# EAGLE design sr_controller_v1_revD (EAGLE 6.3)
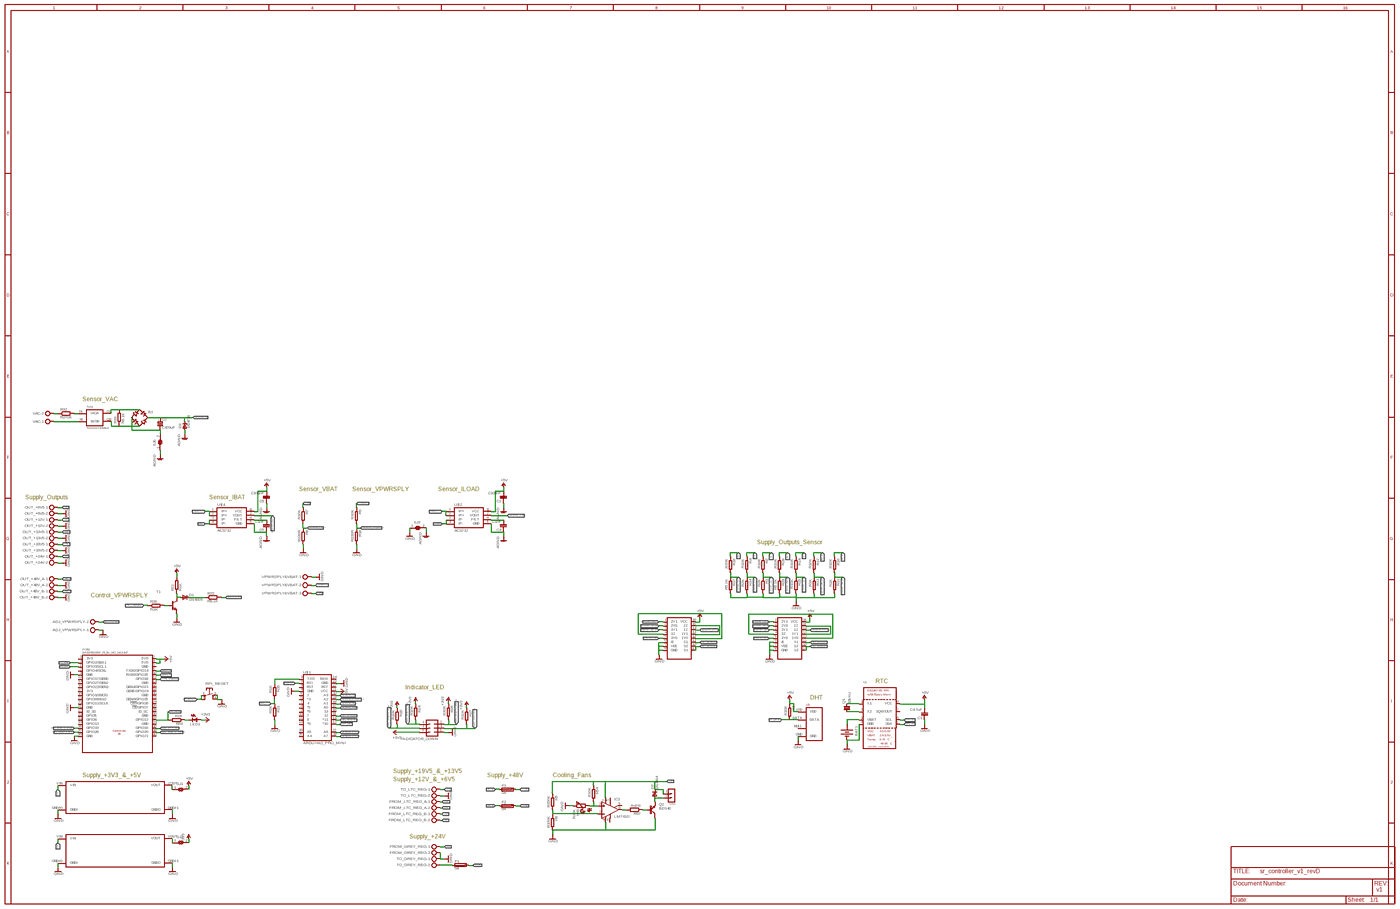
[diagram p0: schematic, sheet 1, overview]
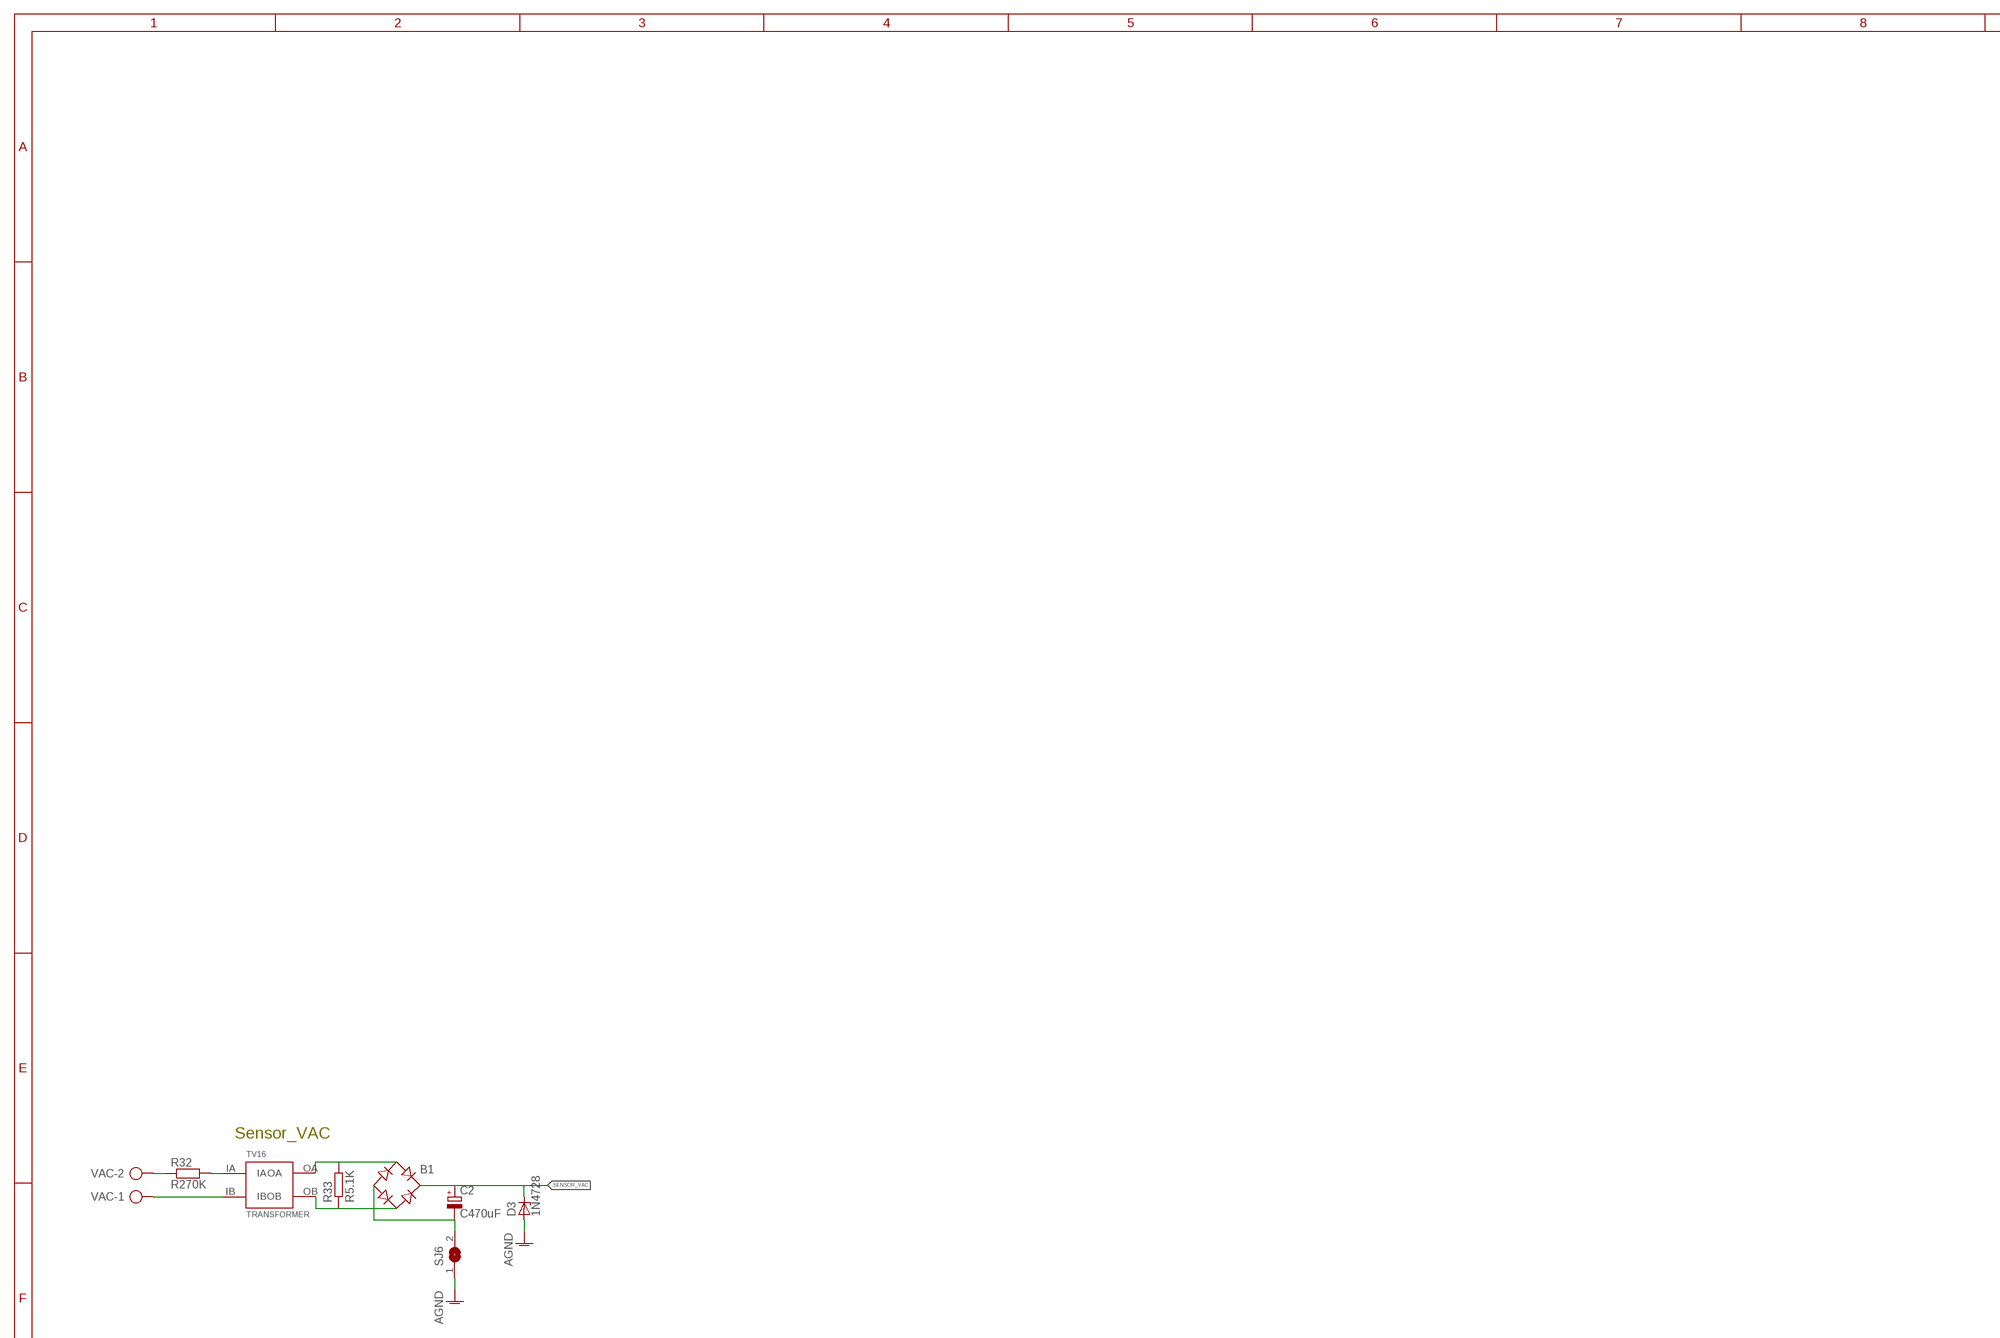
[diagram p1: schematic, sheet 1, part 1 of 4]
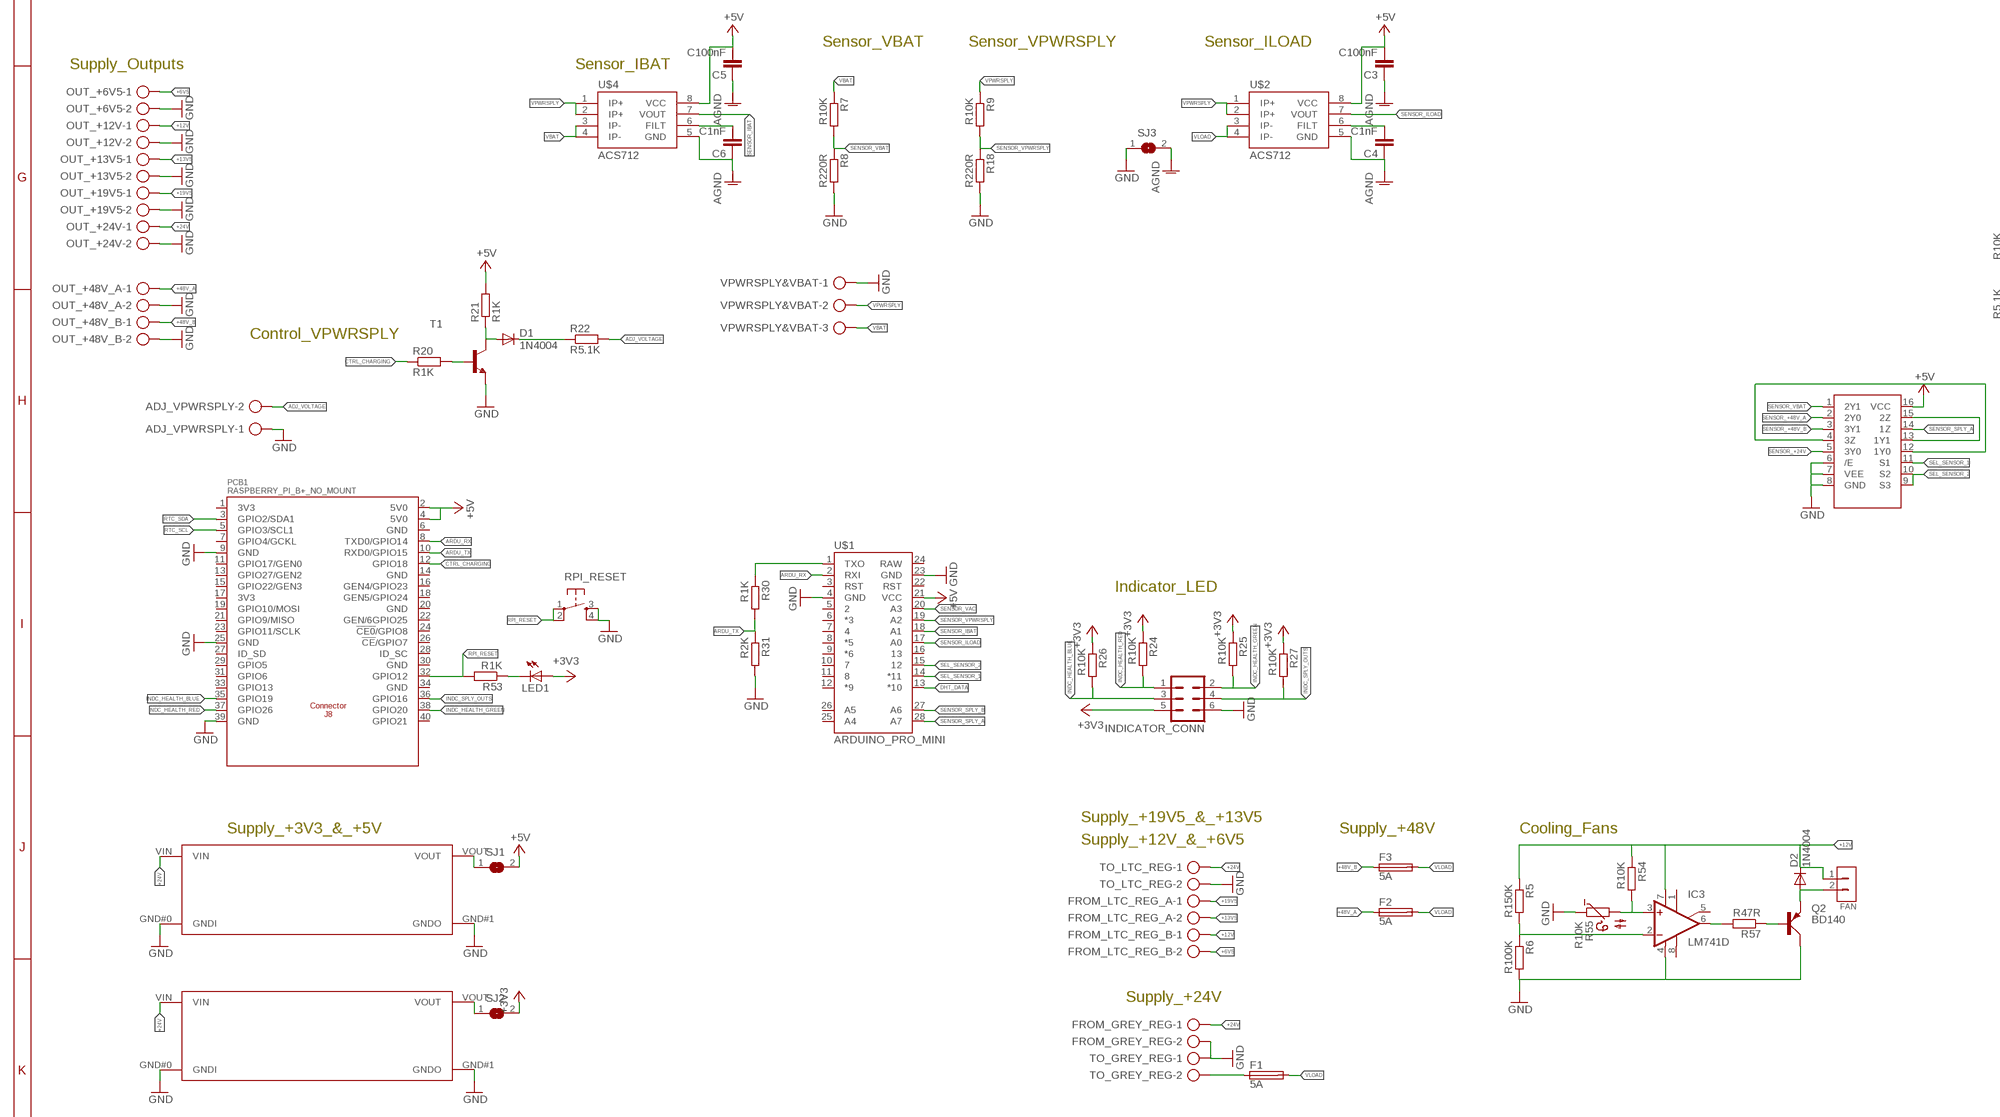
[diagram p2: schematic, sheet 1, part 2 of 4]
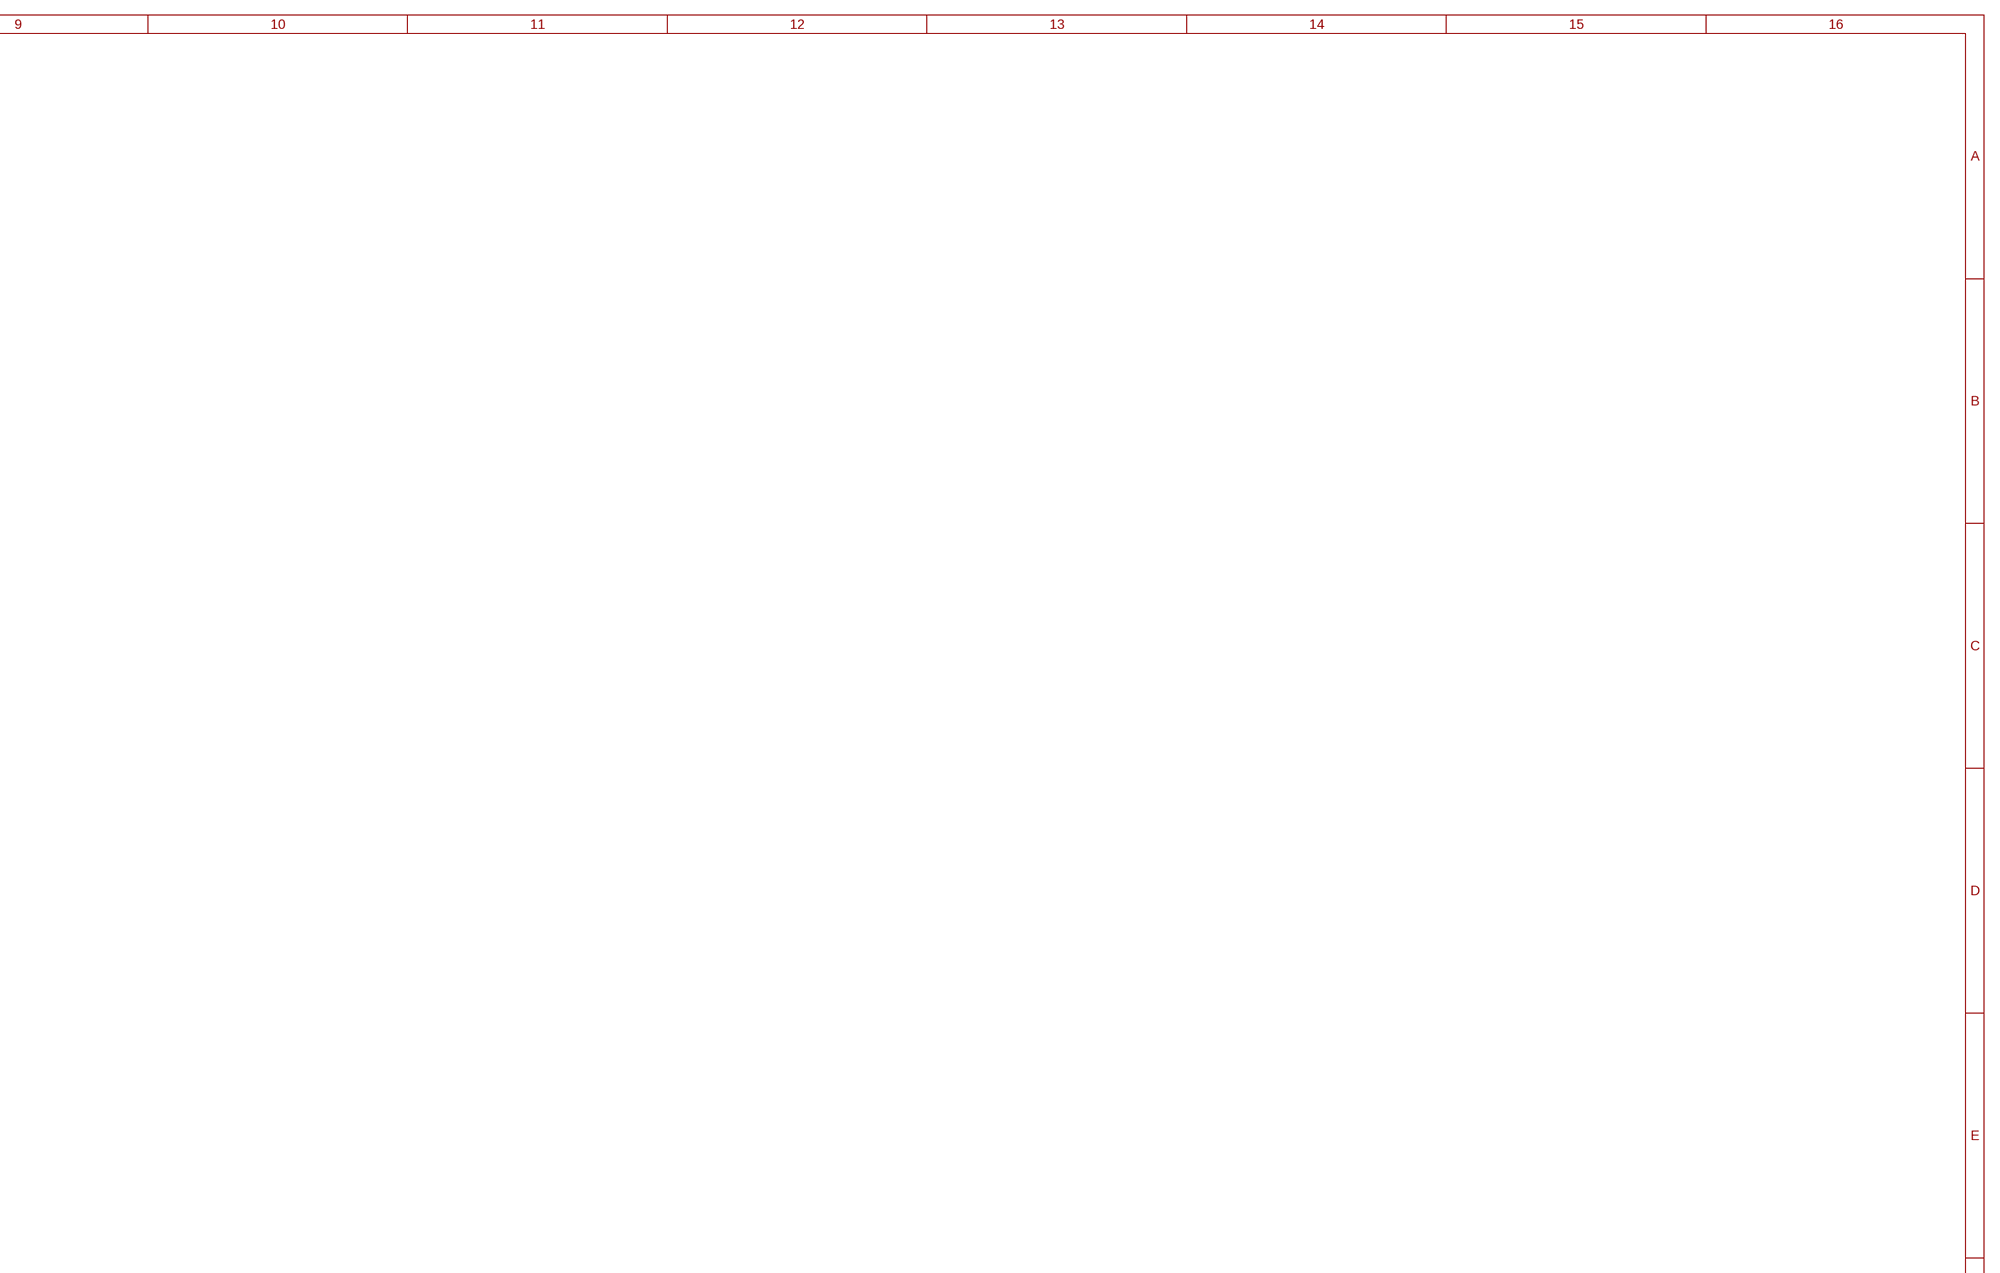
[diagram p3: schematic, sheet 1, part 3 of 4]
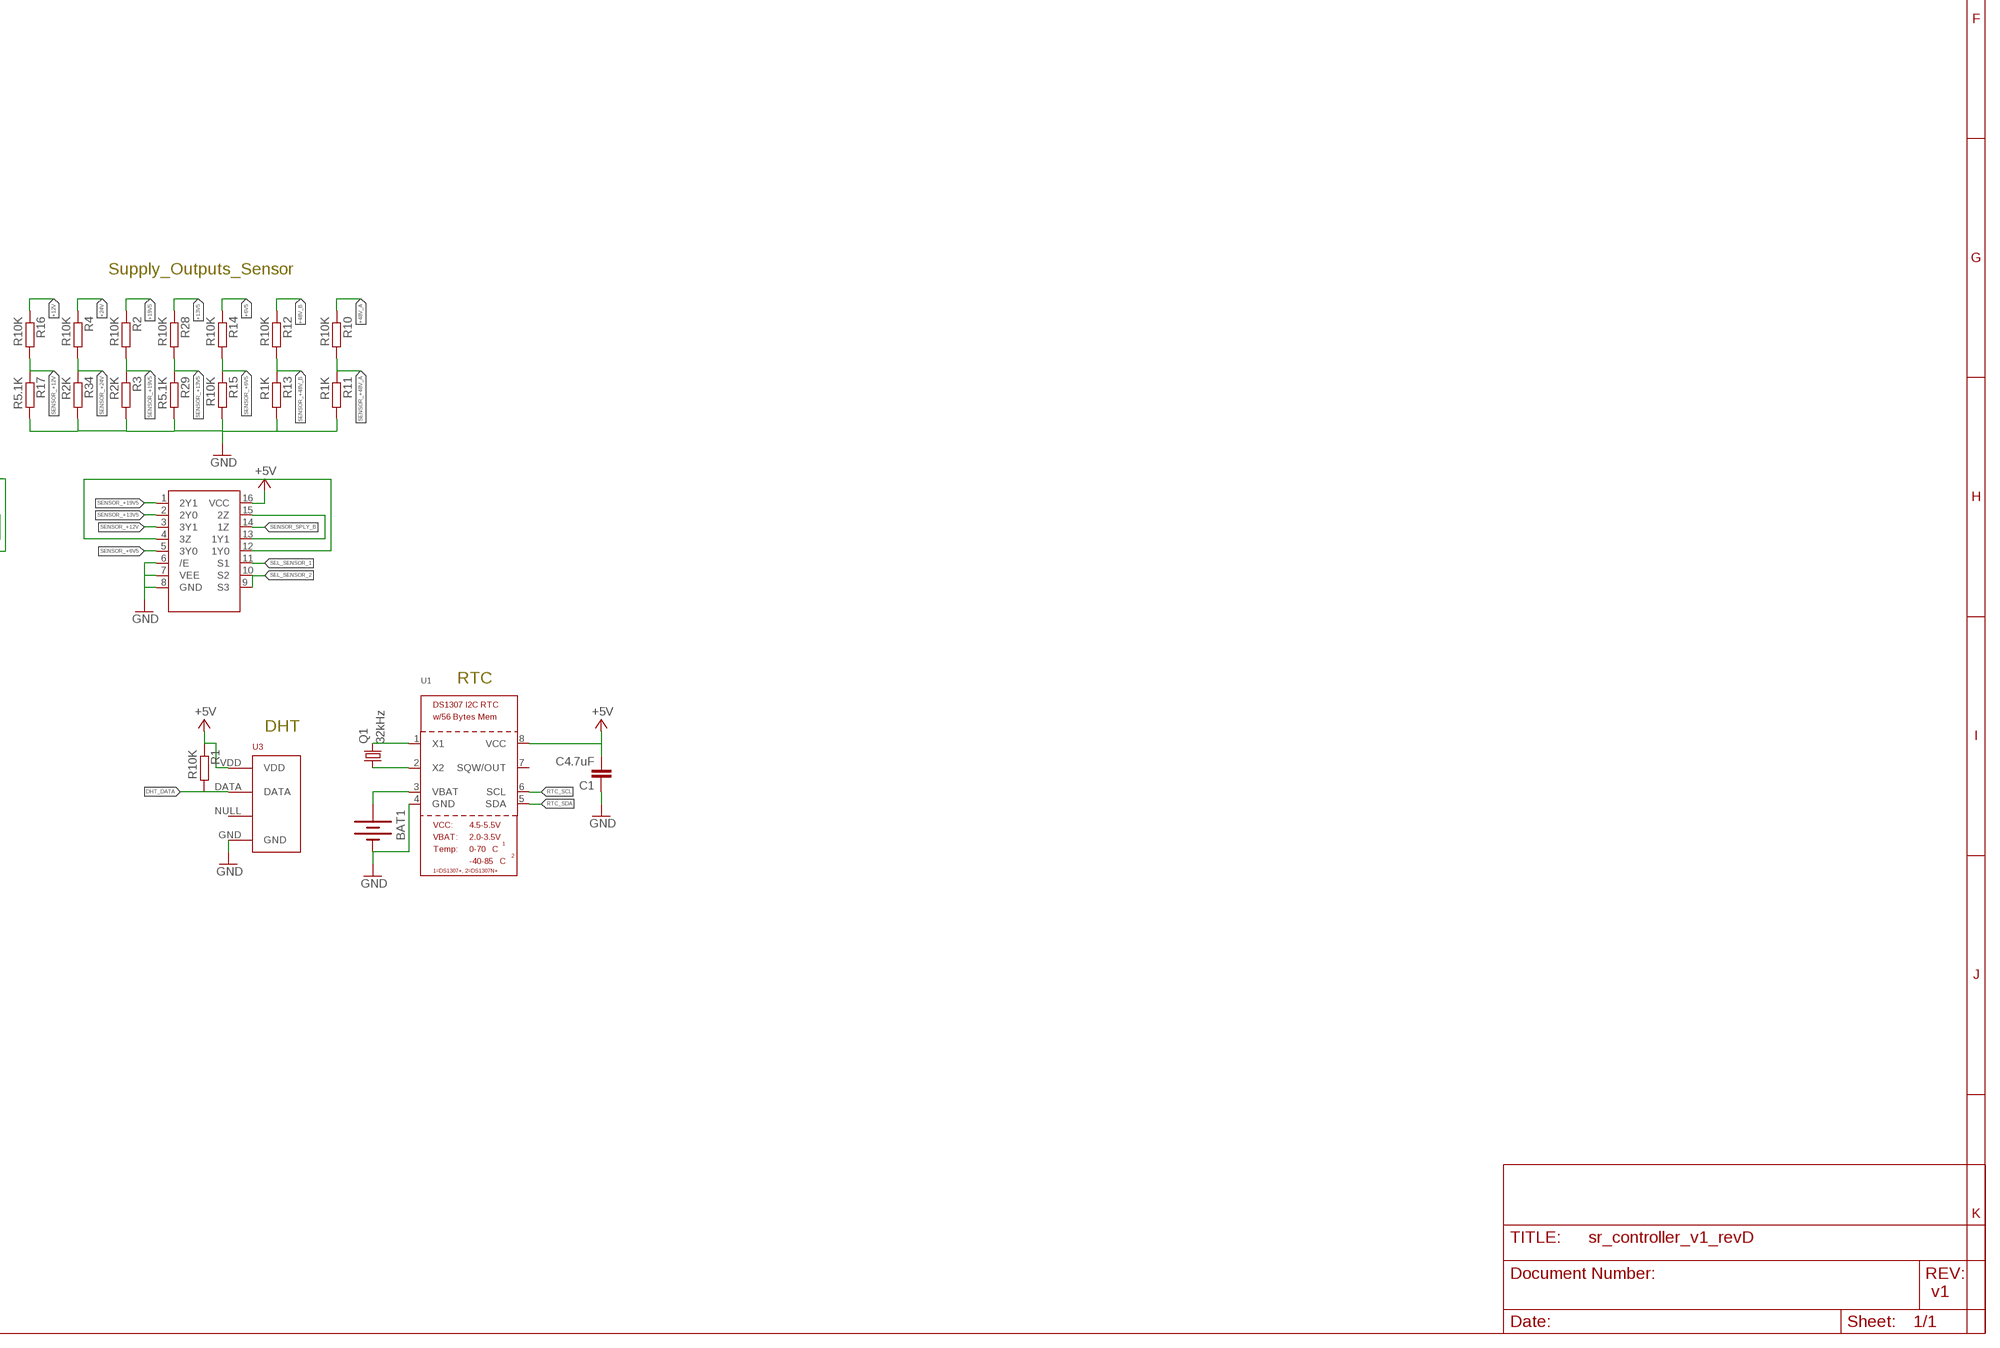
[diagram p4: schematic, sheet 1, part 4 of 4]

## Parts
ADJ_VPWRSPLY  AK300/2  [AK300/2]
B1  RB1A  [RB1A]
BAT1  BATTERY20PTH  [BATTCOM_20MM_PTH]
C1  C4.7uF  C-EUC0805  [C0805]
C2  C470uF  CPOL-EUE3.5-8  [E3,5-8]
C3  C100nF  C-EUC0805K  [C0805K]
C4  C1nF  C-EUC0805K  [C0805K]
C5  C100nF  C-EUC0805K  [C0805K]
C6  C1nF  C-EUC0805K  [C0805K]
D1  1N4004  [DO41-10]
D2  1N4004  [DO41-10]
D3  1N4728  [DO41Z10]
F1  5A  BLADE_FUSE_HOLDER  [BLADE_FUSE_HOLDER]
F2  5A  BLADE_FUSE_HOLDER  [BLADE_FUSE_HOLDER]
F3  5A  BLADE_FUSE_HOLDER  [BLADE_FUSE_HOLDER]
FAN  HEADER_1X02  [HEADER_1X02]
FROM_GREY_REG  AK300/2  [AK300/2]
FROM_LTC_REG_A  AK300/2  [AK300/2]
FROM_LTC_REG_B  AK300/2  [AK300/2]
IC3  LM741D  [SO08]
INDICATOR_CONN  MA03-2  [MA03-2]
LED1  LEDCHIP-LED0805  [CHIP-LED0805]
OUT_+6V5  AK500/2  [AK500/2]
OUT_+12V  AK500/2  [AK500/2]
OUT_+13V5  AK500/2  [AK500/2]
OUT_+19V5  AK500/2  [AK500/2]
OUT_+24V  AK500/2  [AK500/2]
OUT_+48V_A  AK500/2  [AK500/2]
OUT_+48V_B  AK500/2  [AK500/2]
PCB1  RASPBERRY_PI_B+_NO_MOUNT  [RASPBERRY_PI_B+]
Q1  32kHz  CRYSTALTC38H  [TC38H]
Q2  BD140  [TO126AV]
R1  R10K  R-EU_R0805  [R0805]
R2  R10K  R-EU_R0805  [R0805]
R3  R2K  R-EU_R0805  [R0805]
R4  R10K  R-EU_R0805  [R0805]
R5  R150K  R-EU_R0805  [R0805]
R6  R100K  R-EU_R0805  [R0805]
R7  R10K  R-EU_R0805  [R0805]
R8  R220R  R-EU_R0805  [R0805]
R9  R10K  R-EU_R0805  [R0805]
R10  R10K  R-EU_R0805  [R0805]
R11  R1K  R-EU_R0805  [R0805]
R12  R10K  R-EU_R0805  [R0805]
R13  R1K  R-EU_R0805  [R0805]
R14  R10K  R-EU_R0805  [R0805]
R15  R10K  R-EU_R0805  [R0805]
R16  R10K  R-EU_R0805  [R0805]
R17  R5.1K  R-EU_R0805  [R0805]
R18  R220R  R-EU_R0805  [R0805]
R20  R1K  R-EU_R0805  [R0805]
R21  R1K  R-EU_R0805  [R0805]
R22  R5.1K  R-EU_R0805  [R0805]
R24  R10K  R-EU_R0805  [R0805]
R25  R10K  R-EU_R0805  [R0805]
R26  R10K  R-EU_R0805  [R0805]
R27  R10K  R-EU_R0805  [R0805]
R28  R10K  R-EU_R0805  [R0805]
R29  R5.1K  R-EU_R0805  [R0805]
R30  R1K  R-EU_R0805  [R0805]
R31  R2K  R-EU_R0805  [R0805]
R32  R270K  R-EU_0309/10  [0309/10]
R33  R5.1K  R-EU_0309/10  [0309/10]
R34  R2K  R-EU_R0805  [R0805]
R53  R1K  R-EU_R0805  [R0805]
R54  R10K  R-EU_R0805  [R0805]
R55  R10K  NTC642-6  [P642]
R57  R47R  R-EU_R0805  [R0805]
RPI_RESET  TAC_SWITCHPTH  [TACTILE-PTH]
SJ1  SOLDERJUMPER  [SOLDERJUMPER_ARROW_NOPASTE]
SJ2  SOLDERJUMPER  [SOLDERJUMPER_ARROW_NOPASTE]
SJ3  SOLDERJUMPERCLOSED  [SOLDERJUMPER_CLOSEDWIRE]
SJ6  SOLDERJUMPERREFLOW  [SOLDERJUMPER_REFLOW]
T1  MMBT2222ALT1-NPN-SOT23-BEC  [SOT23-BEC]
TO_GREY_REG  AK300/2  [AK300/2]
TO_LTC_REG  AK300/2  [AK300/2]
TV16  TRANSFORMER  [TV16]
U1  RTC_DS1307  [SOIC8_150MIL]
U3  RHT03_DHT-22_AM2302  [RHT03_DHT-22]
U$1  ARDUINO_PRO_MINI  [ARDUINO_PRO_MINI]
U$2  ACS712  [SO08]
U$3  DCDCMODULE  [DCDCMODULE]
U$4  ACS712  [SO08]
U$6  DCDCMODULE  [DCDCMODULE]
U$7  74HC4053D  [SO16]
U$8  74HC4053D  [SO16]
VAC  AK300/2  [AK300/2]
VPWRSPLY&VBAT  AK300/3  [AK300/3]

## Nets
+3V3: INDICATOR_CONN.5 LED1.A R24.1 R25.1 R26.1 R27.1 SJ2.2
+5V: C1.2 C3.2 C5.2 PCB1.2(5V0) PCB1.4(5V0) R1.1 R21.2 SJ1.2 U1.8(VCC) U3.VDD U$1.21(VCC) U$2.8(VCC) U$4.8(VCC) U$7.16(VCC) U$8.16(VCC)
+6V5: FROM_LTC_REG_B.2 OUT_+6V5.1 R14.1
+12V: D2.C FAN.1 FROM_LTC_REG_B.1 IC3.7(V+) OUT_+12V.1 R5.1 R16.1 R54.1
+13V5: FROM_LTC_REG_A.2 OUT_+13V5.1 R28.1
+19V5: FROM_LTC_REG_A.1 OUT_+19V5.1 R2.1
+24V: FROM_GREY_REG.1 OUT_+24V.1 R4.1 TO_LTC_REG.1 U$3.VIN U$6.VIN
+48V_A: F2.1 OUT_+48V_A.1 R10.1
+48V_B: F3.1 OUT_+48V_B.1 R12.1
ADJ_VOLTAGE: ADJ_VPWRSPLY.2 R22.2
AGND: C3.1 C4.1 C5.1 C6.1 D3.A SJ3.2 SJ6.1 U$2.5(GND) U$4.5(GND)
ARDU_RX: PCB1.8(TXD0/GPIO14) U$1.2(RXI)
ARDU_TX: PCB1.10(RXD0/GPIO15) R30.2 R31.1
CTRL_CHARGING: PCB1.12(GPIO18) R20.1
DHT_DATA: R1.2 U3.DATA U$1.13(*10)
GND: ADJ_VPWRSPLY.1 BAT1.2(-) C1.1 FROM_GREY_REG.2 IC3.4(V-) INDICATOR_CONN.6 OUT_+6V5.2 OUT_+12V.2 OUT_+13V5.2 OUT_+19V5.2 OUT_+24V.2 OUT_+48V_A.2 OUT_+48V_B.2 PCB1.9(GND) PCB1.25(GND) PCB1.39(GND) Q2.C R3.2 R6.2 R8.2 R11.2 R13.2 R15.2 R17.2 R18.2 R29.2 R31.2 R34.2 R55.1 RPI_RESET.3 RPI_RESET.4 SJ3.1 T1.E TO_GREY_REG.1 TO_LTC_REG.2 U1.4(GND) U3.GND U$1.4(GND) U$1.23(GND) U$3.GND#0(GNDI) U$3.GND#1(GNDO) U$6.GND#0(GNDI) U$6.GND#1(GNDO) U$7.6(/E) U$7.7(VEE) U$7.8(GND) U$8.6(/E) U$8.7(VEE) U$8.8(GND) VPWRSPLY&VBAT.1
INDC_HEALTH_BLUE: INDICATOR_CONN.3 PCB1.35(GPIO19) R26.2
INDC_HEALTH_GREEN: INDICATOR_CONN.2 PCB1.38(GPIO20) R25.2
INDC_HEALTH_RED: INDICATOR_CONN.1 PCB1.37(GPIO26) R24.2
INDC_SPLY_OUTS: INDICATOR_CONN.4 PCB1.36(GPIO16) R27.2
N$1: R32.1 VAC.2
N$2: TV16.IB VAC.1
N$3: Q1.2 U1.1(X1)
N$4: Q1.1 U1.2(X2)
N$5: BAT1.1(+) U1.3(VBAT)
N$6: U$8.13(1Y1) U$8.15(2Z)
N$7: U$8.4(3Z) U$8.12(1Y0)
N$8: SJ1.1 U$3.VOUT
N$9: SJ2.1 U$6.VOUT
N$10: C4.2 U$2.6(FILT)
N$11: U$7.13(1Y1) U$7.15(2Z)
N$12: LED1.C R53.1
N$15: IC3.3(+IN) R54.2 R55.2
N$16: C6.2 U$4.6(FILT)
N$17: F1.1 TO_GREY_REG.2
N$18: IC3.2(-IN) R5.2 R6.1
N$19: D1.A R21.1 T1.C
N$20: D2.A FAN.2 Q2.E
N$21: B1.AC1 R33.2 TV16.OA
N$22: R20.2 T1.B
N$24: D1.C R22.1
N$26: B1.- C2.- SJ6.2
N$28: U$7.4(3Z) U$7.12(1Y0)
N$35: R30.1 U$1.1(TXO)
N$36: R32.2 TV16.IA
N$38: B1.AC2 R33.1 TV16.OB
N$39: IC3.6(OUT) R57.2
N$40: Q2.B R57.1
RPI_RESET: PCB1.32(GPIO12) R53.2 RPI_RESET.1 RPI_RESET.2
RTC_SCL: PCB1.5(GPIO3/SCL1) U1.6(SCL)
RTC_SDA: PCB1.3(GPIO2/SDA1) U1.5(SDA)
SEL_SENSOR_1: U$1.14(*11) U$7.11(S1) U$8.11(S1)
SEL_SENSOR_2: U$1.15 U$7.9(S3) U$7.10(S2) U$8.9(S3) U$8.10(S2)
SENSOR_+6V5: R14.2 R15.1 U$8.5(3Y0)
SENSOR_+12V: R16.2 R17.1 U$8.3(3Y1)
SENSOR_+13V5: R28.2 R29.1 U$8.2(2Y0)
SENSOR_+19V5: R2.2 R3.1 U$8.1(2Y1)
SENSOR_+24V: R4.2 R34.1 U$7.5(3Y0)
SENSOR_+48V_A: R10.2 R11.1 U$7.2(2Y0)
SENSOR_+48V_B: R12.2 R13.1 U$7.3(3Y1)
SENSOR_IBAT: U$1.18(A1) U$4.7(VOUT)
SENSOR_ILOAD: U$1.17(A0) U$2.7(VOUT)
SENSOR_SPLY_A: U$1.28(A7) U$7.14(1Z)
SENSOR_SPLY_B: U$1.27(A6) U$8.14(1Z)
SENSOR_VAC: B1.+ C2.+ D3.C U$1.20(A3)
SENSOR_VBAT: R7.2 R8.1 U$7.1(2Y1)
SENSOR_VPWRSPLY: R9.2 R18.1 U$1.19(A2)
VBAT: R7.1 U$4.3(IP-) U$4.4(IP-) VPWRSPLY&VBAT.3
VLOAD: F1.2 F2.2 F3.2 U$2.3(IP-) U$2.4(IP-)
VPWRSPLY: R9.1 U$2.1(IP+) U$2.2(IP+) U$4.1(IP+) U$4.2(IP+) VPWRSPLY&VBAT.2
Unconnected: IC3.1(ON1) IC3.5(ON2) IC3.8(OPT) PCB1.1(3V3) PCB1.6(GND) PCB1.7(GPIO4/GCKL) PCB1.11(GPIO17/GEN0) PCB1.13(GPIO27/GEN2) PCB1.14(GND) PCB1.15(GPIO22/GEN3) PCB1.16(GEN4/GPIO23) PCB1.17(3V3) PCB1.18(GEN5/GPIO24) PCB1.19(GPIO10/MOSI) PCB1.20(GND) PCB1.21(GPIO9/MISO) PCB1.22(GEN/6GPIO25) PCB1.23(GPIO11/SCLK) PCB1.24(!CE0!/GPIO8) PCB1.26(!CE!/GPIO7) PCB1.27(ID_SD) PCB1.28(ID_SC) PCB1.29(GPIO5) PCB1.30(GND) PCB1.31(GPIO6) PCB1.33(GPIO13) PCB1.34(GND) PCB1.40(GPIO21) U1.7(SQW/OUT) U3.NULL U$1.3(RST) U$1.5 U$1.6(*3) U$1.7 U$1.8(*5) U$1.9(*6) U$1.10 U$1.11 U$1.12(*9) U$1.16 U$1.22(RST) U$1.24(RAW) U$1.25(A4) U$1.26(A5)

## Notes on the sheet
- Sensor_VAC
- Sensor_VBAT | Sensor_VPWRSPLY | Sensor_ILOAD
- Supply_Outputs | Sensor_IBAT
- Supply_Outputs_Sensor
- Control_VPWRSPLY
- RTC
- Indicator_LED
- DHT
- Supply_+19V5_&_+13V5
- Supply_+3V3_&_+5V | Supply_+48V | Cooling_Fans
- Supply_+12V_&_+6V5
- Supply_+24V
- v1

## Library data of the parts
ADJ_VPWRSPLY FROM_GREY_REG FROM_LTC_REG_A FROM_LTC_REG_B TO_GREY_REG TO_LTC_REG VAC = con-ptr500:AK300/2: CONNECTOR; OC_FARNELL: unknown; OC_NEWARK: unknown
B1 = rectifier:RB1A: RECTIFIER 1 A
BAT1 = SparkFun-Electromechanical:BATTERY: Battery Holders Various common sizes : AA, AAA, 20mm coin cell and 12mm coin cell. 20MM_4LEGS, BATT-10373
C1 C3-C6 = resistor:C-EU: CAPACITOR, European symbol
C2 = resistor:CPOL-EU: POLARIZED CAPACITOR, European symbol
D1 D2 = diode:1N4004: DIODE general purpose rectifier, 1 A
D3 = diode:1N4728: Z DIODE 3.3 V, 1W, 5 percent
F1-F3 = tigorcustom:BLADE_FUSE_HOLDER: FUSE HOLDER CS PFP30, Schukat; OC_FARNELL: unknown; OC_NEWARK: unknown
FAN = microbuilder:HEADER_1X02: 2-Pin 0,254cm / 0.1" Header
IC3 = linear:*741: OP AMP
INDICATOR_CONN = con-lstb:MA03-2: PIN HEADER; OC_FARNELL: unknown; OC_NEWARK: unknown
LED1 = led:LED: LED OSRAM: - CHIPLED LG R971, LG N971, LY N971, LG Q971, LY Q971, LO R971, LY R971 LH N974, LH R974 LS Q976, LO Q976, LY Q976 LO Q996 - Hyper CHIPLED LW Q18S LB Q993, LB Q99A, LB R99A - SideLED LS A670, LO A670, LY A670, LG A670, LP A670 LB A673, LV A673, LT A673, LW A673 LH A674 LY A675 LS A676, LA A676, LO A676, LY A676, LW A676 LS A679, LY A679, LG A679 - Hyper Micro SIDELED® LS Y876, LA Y876, LO Y876, LY Y876 LT Y87S - SmartLED LW L88C, LW L88S LB L89C, LB L89S, LG L890 LS L89K, LO L89K, LY L89K LS L896, LA L896, LO L896, LY L896 - TOPLED LS T670, LO T670, LY T670, LG T670, LP T670 LSG T670, LSP T670, LSY T670, LOP T670, LYG T670 LG T671, LOG T671, LSG T671 LB T673, LV T673, LT T673, LW T673 LH T674 LS T676, LA T676, LO T676, LY T676, LB T676, LH T676, LSB T676, LW T676 LB T67C, LV T67C, LT T67C, LS T67K, LO T67K, LY T67K, LW E67C LS E67B, LA E67B, LO E67B, LY E67B, LB E67C, LV E67C, LT E67C LW T67C LS T679, LY T679, LG T679 LS T770, LO T770, LY T770, LG T770, LP T770 LB T773, LV T773, LT T773, LW T773 LH T774 LS E675, LA E675, LY E675, LS T675 LS T776, LA T776, LO T776, LY T776, LB T776 LHGB T686 LT T68C, LB T68C - Hyper Mini TOPLED® LB M676 - Mini TOPLED Santana® LG M470 LS M47K, LO M47K, LY M47K Source: http://www.osram.convergy.de LUXEON: - LUMILED® LXK2-PW12-R00, LXK2-PW12-S00, LXK2-PW14-U00, LXK2-PW14-V00 LXK2-PM12-R00, LXK2-PM12-S00, LXK2-PM14-U00 LXK2-PE12-Q00, LXK2-PE12-R00, LXK2-PE12-S00, LXK2-PE14-T00, LXK2-PE14-U00 LXK2-PB12-K00, LXK2-PB12-L00, LXK2-PB12-M00, LXK2-PB14-N00, LXK2-PB14-P00, LXK2-PB14-Q00 LXK2-PR12-L00, LXK2-PR12-M00, LXK2-PR14-Q00, LXK2-PR14-R00 LXK2-PD12-Q00, LXK2-PD12-R00, LXK2-PD12-S00 LXK2-PH12-R00, LXK2-PH12-S00 LXK2-PL12-P00, LXK2-PL12-Q00, LXK2-PL12-R00 Source: www.luxeon.com KINGBRIGHT: KA-3528ASYC Source: www.kingbright.com
OUT_+6V5 OUT_+12V OUT_+13V5 OUT_+19V5 OUT_+24V OUT_+48V_A OUT_+48V_B = con-ptr500:AK500/2: CONNECTOR; OC_FARNELL: unknown; OC_NEWARK: unknown
PCB1 = tigorcustom:RASPBERRY_PI_B+_NO_MOUNT: Raspberry Pi B+ Based on issue: Thursday, July 10, 2014 - Rev 1.2 LBR by Tim R. 07-2014
Q1 = crystal:CRYSTAL: CRYSTAL; OC_FARNELL: unknown; OC_NEWARK: unknown
Q2 = transistor-power:BD140: PNP TRANSISTOR
R1-R18 R20-R22 R24-R34 R53 R54 R57 = resistor:R-EU_: RESISTOR, European symbol
R55 = ptc-ntc:NTC642-6: PHILIPS NTC; OC_FARNELL: unknown; OC_NEWARK: unknown
RPI_RESET = SparkFun-Electromechanical:TAC_SWITCH: Momentary Switch Button commonly used for reset or general input. Spark Fun Electronics SKU : COM-00097 SMT- SWCH-08247
SJ1 SJ2 = microbuilder:SOLDERJUMPER: SMD Solder JUMPER Solder the two pads together to create a connection, or remove the solder to break it. REFLOW - Use this footprint for solder paste and reflow ovens. WAVE - Use this footprint for hand-soldering (larger pads). CLOSED - Has a trace between the two pads to ensure it is closed by default. The trace needs to be cut to disable the jumper, and can be closed again by creating a solder bridge between the two pads.; BOM: EXCLUDE
SJ3 SJ6 = microbuilder:SOLDERJUMPER: SMD Solder JUMPER Solder the two pads together to create a connection, or remove the solder to break it. REFLOW - Use this footprint for solder paste and reflow ovens. WAVE - Use this footprint for hand-soldering (larger pads). CLOSED - Has a trace between the two pads to ensure it is closed by default. The trace needs to be cut to disable the jumper, and can be closed again by creating a solder bridge between the two pads.
T1 = transistor:*-NPN-: NPN Transistror BF959 corrected 2008.03.06
TV16 = bontor:TRANSFORMER
U1 = microbuilder:RTC_DS1307: DS1307 I2C RTC with 56-Bytes RAM
U3 = RHT03_DHT-22_AM2302:RHT03_DHT-22_AM2302: RHT03 / DHT-22 / AM2302 Packages and symbol for the RHT03 / DHT-22 relative humidity and temperature sensor. Note: The AM2302 is a wired version of the DHT-22 which typically requires less clearance and is thus provided as a separate package.; PROD_ID: SEN-10167
U$1 = tigorcustom:ARDUINO_PRO_MINI
U$2 U$4 = SparkFun-AnalogIC:ACS712: Hall-effect-based isolated linear current sensor
U$3 U$6 = bontor:DCDCMODULE
U$7 U$8 = tigorcustom:74HC4053D
VPWRSPLY&VBAT = con-ptr500:AK300/3: CONNECTOR; OC_FARNELL: unknown; OC_NEWARK: unknown

## Board
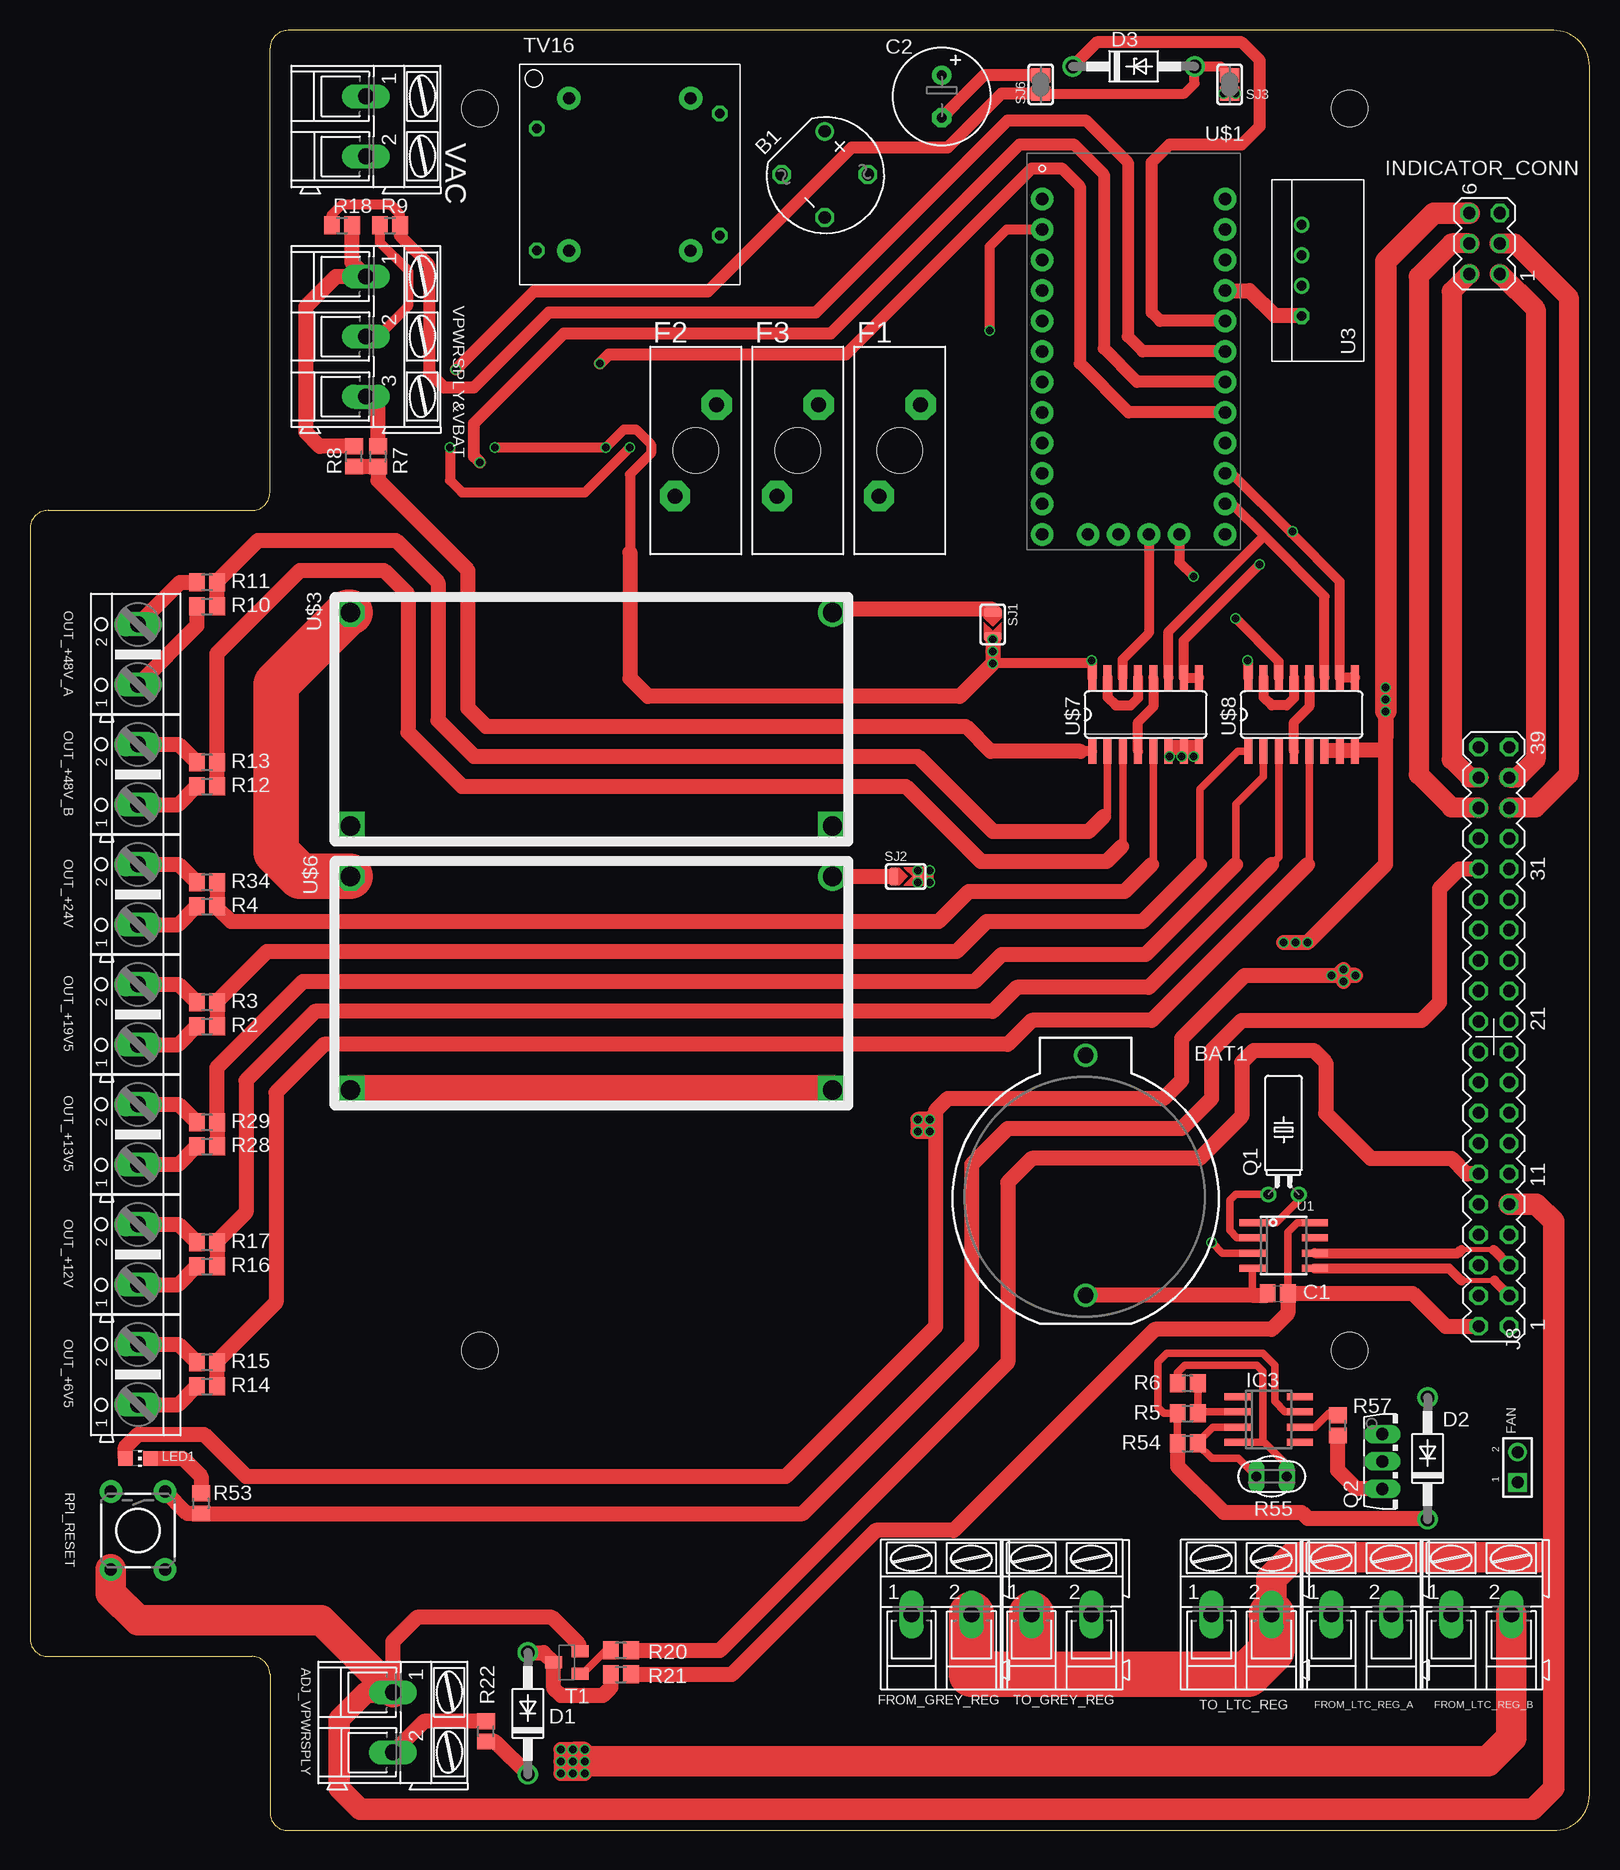
[diagram p5: board, top side]
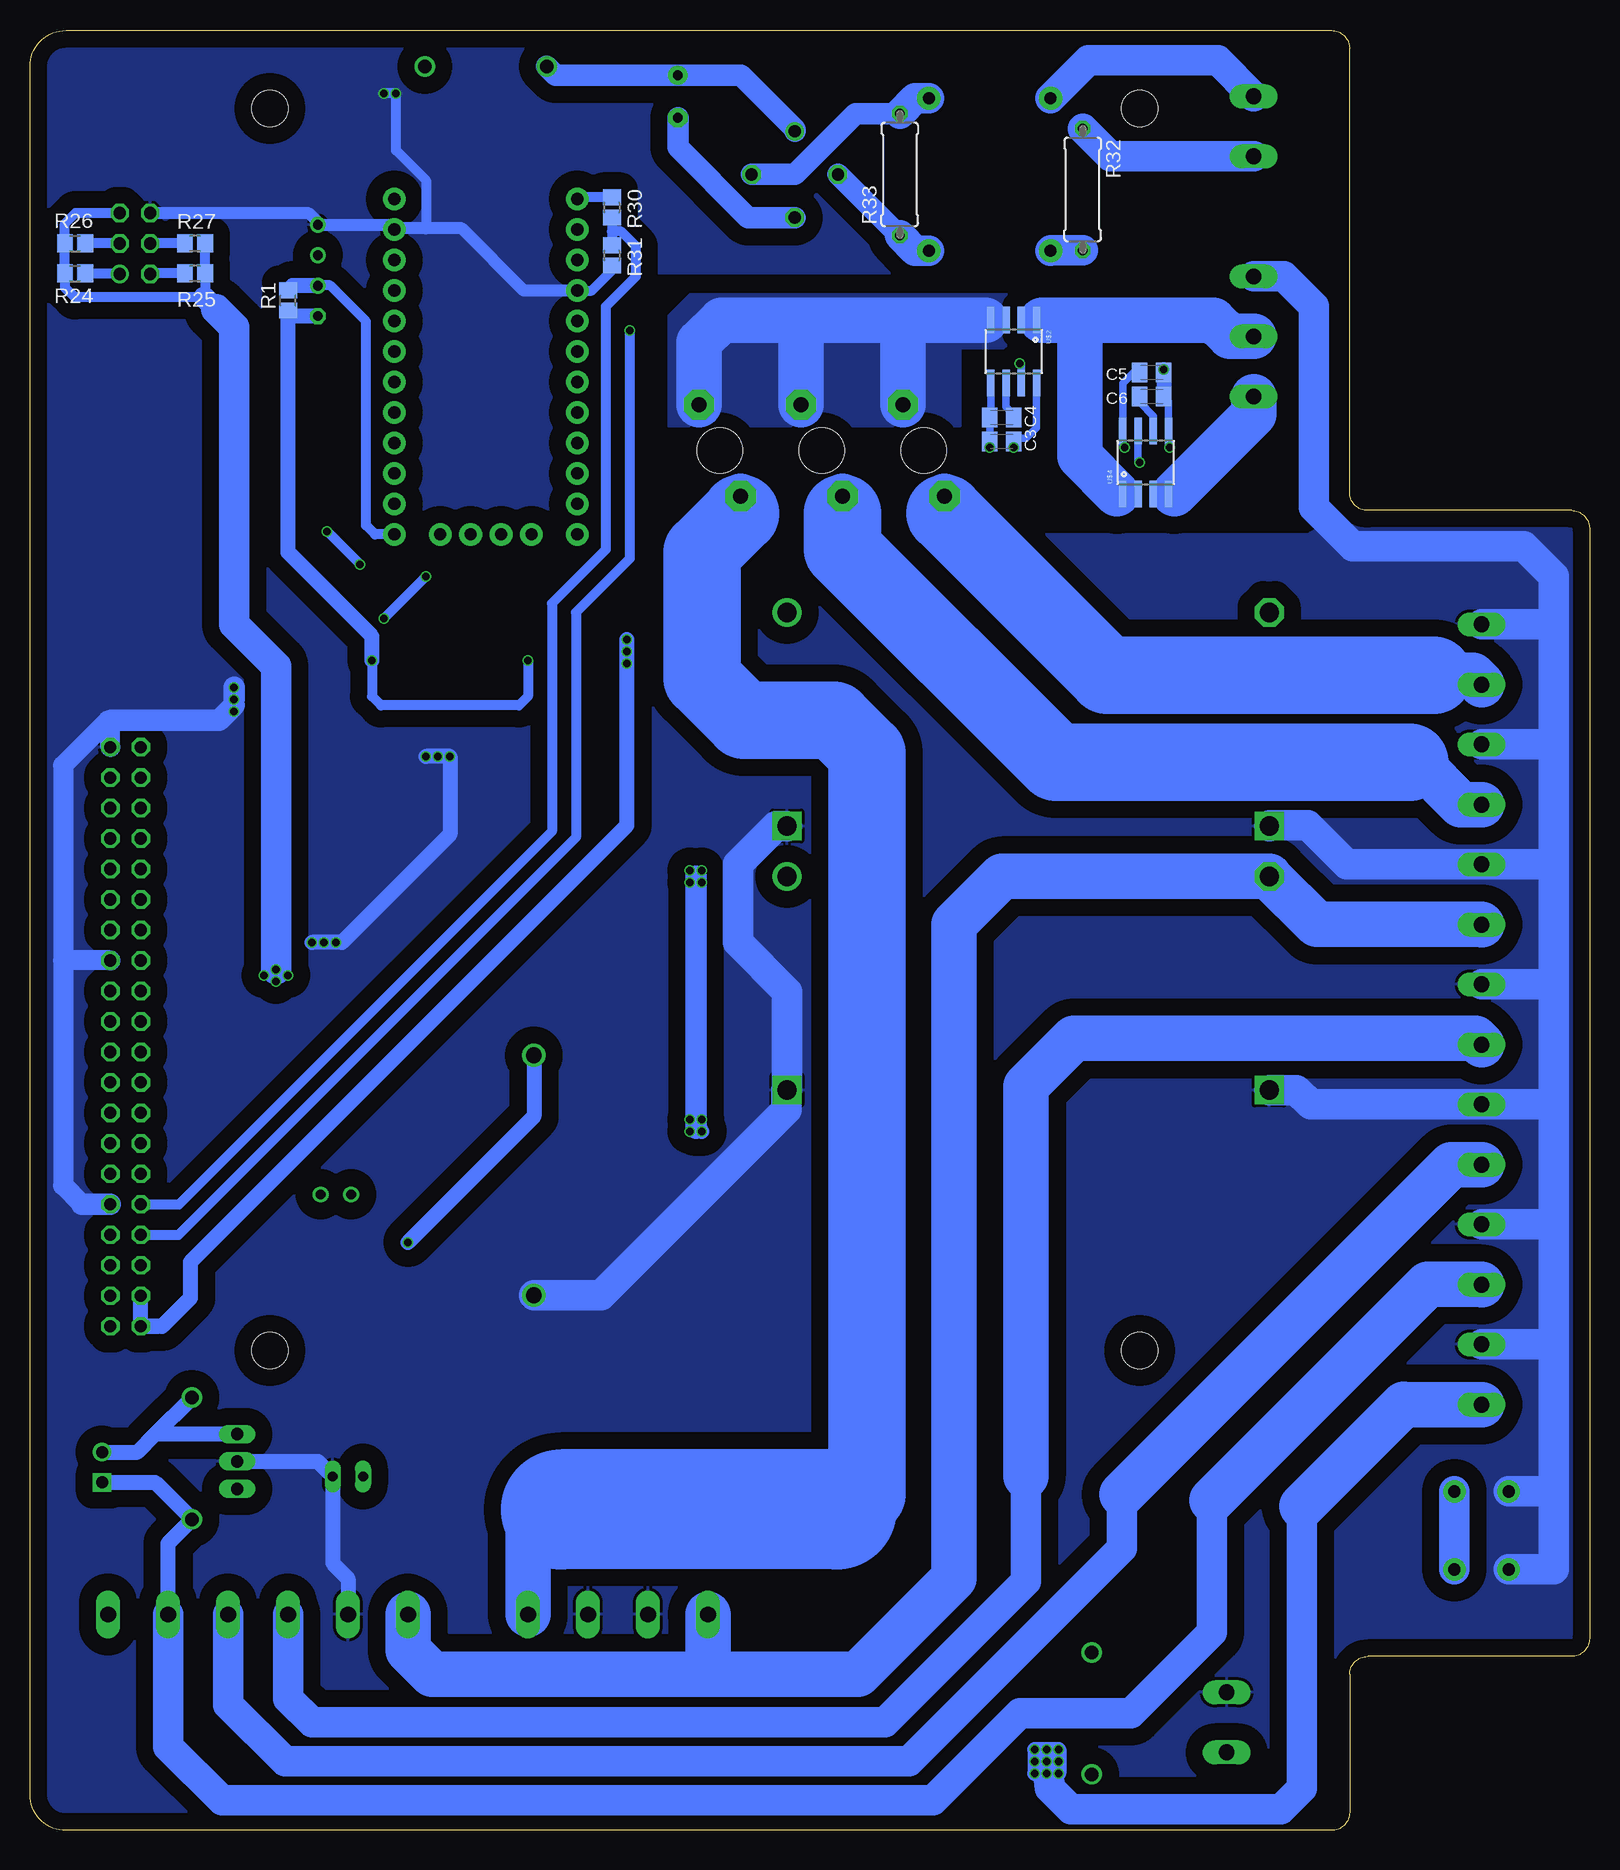
[diagram p6: board, bottom side, seen from below]

Size 130 x 150 mm. Coordinates in mm from the lower left corner, seen from the top.
Outline: 21.5,0 127,0 arc90 130,3 130,147 arc90 127,150 21.5,150 arc90 20,148.5 20,111.5 arc-90 18.5,110 1.5,110 arc90 0,108.5 0,16 arc90 1.5,14.5 18.5,14.5 arc-90 20,13 20,1.5 arc90 21.5,0
Copper layers (1*16): Top 0.035mm / dielectric 1.5mm / Bottom 0.035mm
Design rules "ITEADstudio_DRC": minimum track width 6mil, minimum drill 12mil, track to track 6mil, track to pad 6mil, pad to pad 6mil, via to via 6mil, smd to smd 0mil, copper to edge 10mil, drill to drill 10mil, minimum pad ring 10mil, minimum via ring 6mil, stop-mask expansion 2mil, vias tented up to drill 100mil, thermal gap 10mil
Holes 3 mm at 37.5,40 37.5,143.5 110,143.5 110,40

### Footprints (pad centres in the part's own frame; a part is rotated, then mirrored left to right if it is on the bottom)
AK300/2 = drill 1.321 long: 1 -2.515,0; 2 2.489,0
RB1A = drill 1.016: + -2.54,2.54 | drill 1.016 octagon: - 2.54,-2.54; AC1 2.54,2.54; AC2 -2.54,-2.54
BATTCOM_20MM_PTH = drill 1.3: 1 11.85,0; 2 -8.15,0
C0805 = smd 1.3 x 1.5: 1 -0.85,0; 2 0.85,0
E3,5-8 = drill 0.813 pad 1.6: + -1.778,0 | drill 0.813 pad 1.6 octagon: - 1.778,0
C0805K = smd 1.3 x 1.6: 1 -1,0; 2 1,0
DO41-10 = drill 1.118: A 5.08,0; C -5.08,0
DO41Z10 = drill 1.118: A 5.08,0; C -5.08,0
BLADE_FUSE_HOLDER = drill 1.27 pad 2.54 octagon: 1 1.73,3.81; 2 -1.73,-3.81 | hole 3.78: 0,0
HEADER_1X02 = drill 1 square: 1 0,0 | drill 1: 2 2.54,0
SO08 = smd 0.6 x 2.2: 1 -1.905,-2.6; 2 -0.635,-2.6; 3 0.635,-2.6; 4 1.905,-2.6; 5 1.905,2.6; 6 0.635,2.6; 7 -0.635,2.6; 8 -1.905,2.6
MA03-2 = drill 1.016: 1 -2.54,-1.27 | drill 1.016 octagon: 2 -2.54,1.27; 3 0,-1.27; 4 0,1.27; 5 2.54,-1.27; 6 2.54,1.27
CHIP-LED0805 = smd 1.2 x 1.2: A 0,-1.05; C 0,1.05
AK500/2 = drill 1.321 long: 1 -2.515,0; 2 2.515,0
RASPBERRY_PI_B+ = drill 1.016 octagon: 1 2.02,1.7; 2 2.02,4.24; 3 4.56,1.7; 4 4.56,4.24; 5 7.1,1.7; 6 7.1,4.24; 7 9.64,1.7; 8 9.64,4.24; 9 12.18,1.7; 10 12.18,4.24; 11 14.72,1.7; 12 14.72,4.24; 13 17.26,1.7; 14 17.26,4.24; 15 19.8,1.7; 16 19.8,4.24; 17 22.34,1.7; 18 22.34,4.24; 19 24.88,1.7; 20 24.88,4.24; 21 27.42,1.7; 22 27.42,4.24; 23 29.96,1.7; 24 29.96,4.24; 25 32.5,1.7; 26 32.5,4.24; 27 35.04,1.7; 28 35.04,4.24; 29 37.58,1.7; 30 37.58,4.24; 31 40.12,1.7; 32 40.12,4.24; 33 42.66,1.7; 34 42.66,4.24; 35 45.2,1.7; 36 45.2,4.24; 37 47.74,1.7; 38 47.74,4.24; 39 50.28,1.7; 40 50.28,4.24
TC38H = drill 0.813: 1 -1.27,0; 2 1.27,0
TO126AV = drill 1.016 long: B 2.286,-1.27; C 0,-1.27; E -2.286,-1.27
R0805 = smd 1.3 x 1.5: 1 -0.85,0; 2 0.85,0
0309/10 = drill 0.813 octagon: 1 -5.08,0; 2 5.08,0
P642 = drill 0.813 long: 1 -1.27,0; 2 1.27,0
TACTILE-PTH = drill 1.016 pad 1.88: 1 -3.251,2.261; 2 3.251,2.261; 3 -3.251,-2.261; 4 3.251,-2.261
SOLDERJUMPER_ARROW_NOPASTE = smd 0.762 x 1.524: 1 -1.016,0; 2 1.016,0
SOLDERJUMPER_CLOSEDWIRE = smd 1.168 x 1.6: 1 -0.762,0; 2 0.762,0 | smd 0.635 x 0.203: WIRE 0,0
SOLDERJUMPER_REFLOW = smd 1.168 x 1.6: 1 -0.762,0; 2 0.762,0
SOT23-BEC = smd 1 x 1.4: B -0.95,-1.1; C 0,1.1; E 0.95,-1.1
TV16 = drill 1 pad 1.93: IA -5.08,-6.35; IB -5.08,6.35; OA 5.08,6.35; OB 5.08,-6.35
SOIC8_150MIL = smd 0.6 x 2.2: 1 -1.905,-2.6; 2 -0.635,-2.6; 3 0.635,-2.6; 4 1.905,-2.6; 5 1.905,2.6; 6 0.635,2.6; 7 -0.635,2.6; 8 -1.905,2.6
RHT03_DHT-22 = drill 0.8: DATA -1.27,0; GND 3.81,0; NULL 1.27,0 | drill 0.8 octagon: VDD -3.81,0
ARDUINO_PRO_MINI = drill 1.016 pad 1.88: 1 -7.62,12.7; 2 -7.62,10.16; 3 -7.62,7.62; 4 -7.62,5.08; 5 -7.62,2.54; 6 -7.62,0; 7 -7.62,-2.54; 8 -7.62,-5.08; 9 -7.62,-7.62; 10 -7.62,-10.16; 11 -7.62,-12.7; 12 -7.62,-15.24; 13 7.62,-15.24; 14 7.62,-12.7; 15 7.62,-10.16; 16 7.62,-7.62; 17 7.62,-5.08; 18 7.62,-2.54; 19 7.62,0; 20 7.62,2.54; 21 7.62,5.08; 22 7.62,7.62; 23 7.62,10.16; 24 7.62,12.7; 25 -1.27,-15.24; 26 -3.81,-15.24; 27 3.81,-15.24; 28 1.27,-15.24
SO08' = smd 0.61 x 2.21: 1 -1.905,-2.616; 2 -0.635,-2.616; 3 0.635,-2.616; 4 1.905,-2.616; 5 1.905,2.616; 6 0.635,2.616; 7 -0.635,2.616; 8 -1.905,2.616
DCDCMODULE = drill 1.6 square: GND#0 1.7,1.7; GND#1 41.9,1.7 | drill 1.6 octagon: VIN 1.7,19.5 | drill 1.6: VOUT 41.9,19.5
SO16 = smd 0.66 x 2.032: 1 -4.445,-3.073; 2 -3.175,-3.073; 3 -1.905,-3.073; 4 -0.635,-3.073; 5 0.635,-3.073; 6 1.905,-3.073; 7 3.175,-3.073; 8 4.445,-3.073; 9 4.445,3.073; 10 3.175,3.073; 11 1.905,3.073; 12 0.635,3.073; 13 -0.635,3.073; 14 -1.905,3.073; 15 -3.175,3.073; 16 -4.445,3.073
AK300/3 = drill 1.321 long: 1 -5.004,0; 2 0,0; 3 5.004,0

### Placement (x,y rotation side)
ADJ_VPWRSPLY  30.25,9 270 top
B1  66.25,138 315 top
BAT1  88,52.75 90 top
C1  104,44.75 0 top
C2  76,144.5 270 top
C3  49,115.75 0 bottom
C4  49,117.75 0 bottom
C5  36.5,121.5 180 bottom
C6  36.5,119.5 180 bottom
D1  41.5,9.75 90 top
D2  116.5,31 90 top
D3  92,147 0 top
F1  72.5,115 180 top
F2  55.5,115 180 top
F3  64,115 180 top
FAN  124,29 90 top
FROM_GREY_REG  76,18 0 top
FROM_LTC_REG_A  111,18 0 top
FROM_LTC_REG_B  121,18 0 top
IC3  103.25,34.25 270 top
INDICATOR_CONN  121.25,132.25 90 top
LED1  9,31 270 top
OUT_+6V5  9,38 90 top
OUT_+12V  9,48 90 top
OUT_+13V5  9,58 90 top
OUT_+19V5  9,68 90 top
OUT_+24V  9,78 90 top
OUT_+48V_A  9,98 90 top
OUT_+48V_B  9,88 90 top
PCB1  125,40 90 top
Q1  104.5,53 0 top
Q2  114,30.75 270 top
R1  108.5,127.5 90 bottom
R2  14.75,67 0 top
R3  14.75,69 180 top
R4  14.75,77 0 top
R5  96.5,34.75 0 top
R6  96.5,37.25 180 top
R7  29,114.5 270 top
R8  27,114.5 90 top
R9  30,133.75 0 top
R10  14.75,102 0 top
R11  14.75,104 180 top
R12  14.75,87 0 top
R13  14.75,89 180 top
R14  14.75,37 0 top
R15  14.75,39 180 top
R16  14.75,47 0 top
R17  14.75,49 180 top
R18  26,133.75 0 top
R20  49.25,15 180 top
R21  49.25,13 0 top
R22  38,8.25 90 top
R24  126.25,129.75 0 bottom
R25  116.25,129.75 180 bottom
R26  126.25,132.25 0 bottom
R27  116.25,132.25 180 bottom
R28  14.75,57 0 top
R29  14.75,59 180 top
R30  81.5,135.25 270 bottom
R31  81.5,131.25 270 bottom
R32  42.25,136.75 270 bottom
R33  57.5,138 90 bottom
R34  14.75,79 180 top
R53  14.25,27.25 270 top
R54  96.5,32.25 0 top
R55  103.5,29.5 180 top
R57  109,33.75 90 top
RPI_RESET  9,25 270 top
SJ1  80.25,100.5 270 top
SJ2  73,79.5 0 top
SJ3  100,145.5 90 top
SJ6  84.25,145.5 90 top
T1  44.75,14 90 top
TO_GREY_REG  86,18 0 top
TO_LTC_REG  101,18 0 top
TV16  50,138 0 top
U1  104.5,48.75 270 top
U3  106,130 90 top
U$1  92,123.25 0 top
U$2  ACS712  [SO08']  48,123.25 180 bottom
U$3  25,82 0 top
U$4  ACS712  [SO08']  37,114 0 bottom
U$6  25,60 0 top
U$7  93,93 0 top
U$8  106,93 0 top
VAC  28,142 270 top
VPWRSPLY&VBAT  28,124.5 270 top

### Tracks (layer width: path | path; a pad name or v marks a point on that pad's centre or on a via)
+3V3  (via drill 0.6)
  Top 0.61: v74,79 v75,79 75,79.5 | 75,79.5 v75,80 v74,80 74,79.52 SJ2.2 75,79.5
  Top 1.27: 109.5,71.25 v110.5,71.25 101.25,71.25 96,66 96,62.5 94.5,61 76.5,61 75.5,60 75.5,59.75 | 109.5,71.25 v109.5,70.75 | 109.5,71.25 v109.5,71.75 109,71.25 v108.5,71.25 | 75.5,59.75 75.5,42 63,29.5 18,29.5 14.5,33 9,33 7.95,31.95 LED1.A | v75,58.25 v74,58.25 v74,59.25 v75,59.25 75.5,59.75
  Bottom 0.254: 74.5,79.5 SJ2.2
  Bottom 0.813: R27.1 R25.1 115.4,127.85 115.5,127.75 126.25,127.75 127.1,128.6 R24.1 R26.1 127.1,133.9 126.21,134.79 INDICATOR_CONN.5
  Bottom 1.27: 74.5,58.5 74.25,58.5 v74,58.25
  Bottom 1.778: 114.5,126.75 115.5,127.75 | 74.5,79.5 74.5,58.5
  Bottom 2.54: 114.5,126.75 113,125.25 113,100.5 109.5,97 v109.5,71.75
+5V  (via drill 0.6)
  Top 0.61: C1.2 104.85,49.85 105.66,50.66 U1.8 | SJ1.2 v80.25,99.25
  Top 0.813: v80.25,97.25 88.25,97.25 v88.5,97.5 88.56,97.44 U$7.16 | U$8.16 101.56,97.44 v101.5,97.5 | v38.75,115.25 v48,115.25 49.5,116.75 50.5,116.75 51.75,115.5 51.75,114.75 50,113 50,106.5
  Top 1.27: U$1.21 101.67,128.33 103.75,126.25 105.94,126.25 U3.VDD | R21.2 58.5,13 70.5,25 77,25 93.75,41.75 103.5,41.75 104.85,43.1 C1.2 115.25,44.75 118,42 120.74,42 PCB1.2 | v80.25,99.25 v80.25,98.25 v80.25,97.25 77.5,94.5 51.5,94.5 50,96 50,106.5
  Bottom 0.61: C5.2 38,121.5 38.91,120.59 U$4.8 38.91,115.41 v38.75,115.25 | U$2.8 46.09,116.91 47,116 47.75,116 C3.2 v48,115.25
  Bottom 0.813: v88.5,97.5 88.5,94.5 89.25,93.75 100.75,93.75 101.5,94.5 v101.5,97.5
  Bottom 1.27: U3.VDD 108.04,126.19 R1.1 108.5,106.5 101.5,99.5 v101.5,97.5 | PCB1.2 119.23,42.02 | v80.25,99.25 80.25,83.75 116.62,47.38 116.62,44.38 119,42 120.74,42 PCB1.2 | PCB1.2 PCB1.4
+6V5  (via drill 0.6)
  Top 1.27: OUT_+6V5.1 12.38,35.48 R14.1 | v46.25,5.75 v46.25,4.75 v45.25,4.75 v44.25,4.75 v44.25,5.75 v44.25,6.75 v45.25,6.75 v46.25,6.75
  Top 2.54: FROM_LTC_REG_B.2 123.49,7.74 121.5,5.75 v46.25,5.75 v45.25,5.75
  Bottom 1.27: v44.25,4.75 v44.25,6.75 v46.25,6.75 v46.25,4.75
  Bottom 2.54: v45.25,5.75 45,3.5 43.25,1.75 25.75,1.75 24,3.5 24,27
  Bottom 3.81: OUT_+6V5.1 15.48,35.48 15.5,35.5 24,27
+12V
  Top 0.61: R54.1 R5.1 94.5,34.75 94,35.25 94,39 94.75,39.75 102.75,39.75 103.75,38.75 103.75,35.75 104.61,34.88 IC3.7
  Top 1.27: OUT_+12V.1 12.38,45.48 R16.1 | R54.1 95.65,30.35 99.5,26.5 106,26.5 106.5,26 116.42,26 D2.C
  Bottom 1.27: FROM_LTC_REG_B.1 118.48,23.93 D2.C 119.58,29 FAN.1
  Bottom 2.54: FROM_LTC_REG_B.1 118.48,6.99 114,2.5 54.75,2.5 47.5,9.75 38.25,9.75 31.5,16.5 31.5,27.5
  Bottom 3.81: OUT_+12V.1 9.02,45.5 13.5,45.5 31.5,27.5
+13V5
  Top 1.27: R28.1 12.38,55.48 OUT_+13V5.1
  Bottom 2.54: FROM_LTC_REG_A.2 113.49,10.49 108.75,5.75 56.75,5.75 39,23.5 39,28
  Bottom 3.81: OUT_+13V5.1 11.52,55.48 39,28
+19V5
  Top 1.27: OUT_+19V5.1 12.38,65.48 R2.1
  Bottom 2.54: FROM_LTC_REG_A.1 108.48,10.98 106.5,9 58.75,9 47,20.75 47,29.5
  Bottom 3.81: 9.02,65.5 OUT_+19V5.1 9.52,66 43,66 47,62 47,29.5
+24V
  Top 1.27: OUT_+24V.1 12.38,75.48 R4.1
  Top 3.81: U$3.VIN 26.5,101.5 20.5,95.5 20.5,81.5 22.5,79.5 U$6.VIN
  Bottom 3.81: 73.25,13 76.5,13 | 76.5,13 96.5,13 98.5,15 98.5,17.98 TO_LTC_REG.1 | 76.48,13.02 76.5,13 | OUT_+24V.1 9.02,75.5 22.75,75.5 26.7,79.45 U$6.VIN 49,79.5 53,75.5 53,21 61,13 73.25,13 | FROM_GREY_REG.1 73.48,13.23 73.25,13
+48V_A
  Top 1.27: R10.1 13.9,100.39 OUT_+48V_A.1
  Bottom 3.81: OUT_+48V_A.1 9.75,96.25 13,96.25 | F2.1 53.77,109.77 53.75,109.75
  Bottom 6.452: 13,96.25 40.25,96.25 53.75,109.75
+48V_B
  Top 1.27: OUT_+48V_B.1 12.38,85.48 R12.1
  Bottom 3.81: F3.1 62.27,109.77 | OUT_+48V_B.1 10.73,85.48 14.25,89 15,89
  Bottom 6.452: 15,89 37.5,89 37.75,89 44.5,89 62.27,106.77 62.27,109.77
ADJ_VOLTAGE
  Top 1.27: ADJ_VPWRSPLY.2 31.84,8.1 31.85,8.1 32.85,9.1 R22.2
AGND  (via drill 0.6)
  Top 0.813: v35,115.25 35,112.5 36,111.5 46.25,111.5 v50,115.25 | SJ6.1 96.24,144.74 97.08,145.58 D3.A 99.26,147 SJ3.2 99.74,146.26
  Top 1.016: 84.26,144.74 SJ6.1 81.49,144.74 81.48,144.75 81,144.75 76.5,140.25 68.5,140.25 56.5,128.25 42,128.25 v35.5,121.75
  Bottom 0.61: C6.1 35.09,119.09 U$4.5 35.09,115.34 v35,115.25 | U$2.5 49.91,117.84 C4.1 C3.1 v50,115.25
  Bottom 1.27: C6.1 C5.1 v35.5,121.75
ARDU_RX  (via drill 0.6)
  Top 0.813: v80,125 80,132 81.41,133.41 U$1.2
  Bottom 0.813: PCB1.8 117.61,49.64 84.5,82.75 84.5,101.5 80,106 v80,125
ARDU_TX
  Bottom 0.813: PCB1.10 117.57,52.18 86.5,83.25 86.5,102.25 82,106.75 82,127 79.5,129.5 79.5,132 80.75,133.25 81.5,133.25 | R30.2 81.5,133.25 | 81.5,133.25 R31.1
CTRL_CHARGING
  Top 1.27: R20.1 57.5,15 81.5,39 81.5,54 83.5,56 97.5,56 101,59.5 101,64 102,65 107,65 108,64 108,59.75 111.75,56 118.5,56 119.78,54.72 PCB1.12
DHT_DATA
  Bottom 0.813: U$1.13 101.24,108.01 101.25,108 102,108.75 102,125.75 105,128.75 105.98,128.75 U3.DATA
  Bottom 1.27: U3.DATA 108.12,128.73 R1.2
GND  (via drill 0.6)
  Top 0.61: R55.1 104.77,30.48 102.91,32.34 102.75,32.34 | IC3.4 102.75,32.34 | R6.2 95.65,38.15 96.25,38.75 102.25,38.75 102.75,38.25 102.75,32.34 | U1.4 101.9,44.7 102,44.6 | T1.E 45.85,15.4 45.75,15.5 | 108.25,90 108.18,89.93 U$8.6 | 110,90 109.25,90 U$8.7 U$8.8 | U$7.6 94.93,89.93 | 94.93,89.93 95.25,90.25 | U$7.8 97.12,90.25 97,90.25 96.5,90.25 U$7.7 96.17,89.67 v96,89.5 | 94.93,89.93 94.93,89.57 v95,89.5
  Top 0.813: SJ3.1 100.49,144.74 v100.5,144.75
  Top 1.27: OUT_+48V_B.2 12.38,90.52 R13.2 | OUT_+24V.2 12.38,80.52 R34.2 | OUT_+19V5.2 12.38,70.52 R3.2 | OUT_+13V5.2 12.38,60.52 R29.2 | OUT_+12V.2 12.38,50.52 R17.2 | 30.27,11.5 ADJ_VPWRSPLY.1 30.25,15.75 32.25,17.75 43.5,17.75 45.75,15.5 | C1.1 103,44.6 102,44.6 BAT1.2 | OUT_+48V_A.2 9.02,100.52 12.5,104 R11.2 | OUT_+6V5.2 12.38,40.52 R15.2 | 126.25,22.75 127,22.75 | 108.25,90 110,90 | 95.25,90.25 97,90.25 | R8.2 24.15,115.35 23,116.5 23,127 25.5,129.5 VPWRSPLY&VBAT.1 27,130.5 26.85,130.65 R18.2 | v113,93.25 113,91 | 113,90 110.52,90 U$8.8 | v104.5,74 v105.5,74 v106.5,74 113,80.5 113,90 | 113,90 v113,95.25
  Top 1.778: PCB1.9 125.57,52.18 127,50.75 127,22.75 127,3.5 125.25,1.75 27.5,1.75 25.75,3.5 25.75,9.25 28,11.5 30.23,11.5 ADJ_VPWRSPLY.1 | INDICATOR_CONN.6 117.04,134.79 113,130.75 v113,95.25 v113,93.25
  Top 2.54: U$6.GND#1 U$6.GND#0 | TO_LTC_REG.2 103.49,20.99 105.25,22.75 126.25,22.75 | RPI_RESET.4 6.74,19.76 9,17.5 24.27,17.5 ADJ_VPWRSPLY.1
  Top 3.81: 83.5,13 78.5,13 78.49,13.01 FROM_GREY_REG.2 | 83.5,13 101.5,13 103.5,15 TO_LTC_REG.2 | TO_GREY_REG.1 83.48,13.02 83.5,13
  Bottom 0.813: v113,93.25 113,93.75 v113,94.25 | v100.5,144.75 v99.5,144.75 99.5,140 97,137.5 97,133.5 | U$1.4 83.17,128.33 81.5,130 R31.2
  Bottom 1.016: INDICATOR_CONN.6 119.94,134.75 106.75,134.75 106,134 U3.GND 100.02,133.81 U$1.23 99.53,133.5 97,133.5 94,133.5 88.83,128.33 U$1.4
  Bottom 1.27: Q2.C 106.02,30.75 R55.1 104.77,22.27 103.49,20.99 TO_LTC_REG.2 | v106.5,74 104,74 95,83 v95,89.5 v97,89.5
  Bottom 1.676: 127.25,72.5 127.25,88.75 123.5,92.5 123.25,92.5 123.3,92.45 PCB1.39 | 127.25,72.5 127.25,53.75 125.68,52.18 | PCB1.25 127.25,72.5
  Bottom 1.778: PCB1.9 125.68,52.18 | 123.25,92.5 114.25,92.5 113,93.75 | v113,94.25 v113,95.25
  Bottom 2.54: 3,100.5 3,104.5 5.5,107 19.75,107 23,110.25 23,127 25.5,129.5 27.5,129.5 VPWRSPLY&VBAT.1 | 3,100.5 3,90.5 | 3,90.5 3,80.25 | 3,80.25 3,70.5 | 3,70.5 3,60.5 | 3,60.5 3,50.5 | OUT_+6V5.2 8.98,40.5 3,40.5 | OUT_+48V_A.2 3.02,100.52 3,100.5 | OUT_+48V_B.2 3.02,90.52 3,90.5 | 3,80.25 3.27,80.52 OUT_+24V.2 9.02,80.5 20.25,80.5 23.5,83.75 26.65,83.75 U$3.GND#0 | OUT_+19V5.2 3.02,70.52 3,70.5 | 3,60.5 3.02,60.52 OUT_+13V5.2 9.02,60.5 23.25,60.5 24.45,61.7 U$6.GND#0 | OUT_+12V.2 3.02,50.52 3,50.5 | 3,50.5 3,40.5 | 3,40.5 3,28.25 | RPI_RESET.3 3,28.25 | 3,28.25 3,21.75 RPI_RESET.4 | BAT1.2 82.4,44.6 66.95,60.05 66.95,61.75 U$6.GND#1 66.9,69.9 71,74 71,80.5 67.8,83.7 U$3.GND#1
  pour Bottom (isolate 1.422): 50.5,150 50.5,129.75 78,129.75 78,115 52.5,115 45.5,108 23.5,108 20,110 0,110 -0.25,14.5 20,14.5 20,0 130,0 130,150
INDC_HEALTH_BLUE
  Top 1.676: INDICATOR_CONN.3 123.75,132.25 128.25,127.75 128.25,88 125.5,85.25 123.35,85.25 PCB1.35
  Bottom 0.813: INDICATOR_CONN.3 R26.2
INDC_HEALTH_GREEN
  Top 1.676: INDICATOR_CONN.2 119.96,129.71 118.5,128.25 118.5,89.25 120,87.75 PCB1.38
  Bottom 0.813: R25.2 119.94,129.75 INDICATOR_CONN.2
INDC_HEALTH_RED
  Top 1.676: INDICATOR_CONN.1 122.54,129.71 125.5,126.75 125.5,89.25 124,87.75 123.75,87.75 123.74,87.74 PCB1.37
  Bottom 0.813: INDICATOR_CONN.1 125.36,129.71 R24.2
INDC_SPLY_OUTS
  Top 1.676: INDICATOR_CONN.4 118.5,132.25 115.75,129.5 115.75,88 118.5,85.25 120.71,85.25 PCB1.36
  Bottom 0.813: R27.2 INDICATOR_CONN.4
N$1
  Bottom 2.54: VAC.2 39.93,139.51 R32.1
N$2
  Bottom 2.54: VAC.1 28.02,144.51 31,147.5 41.77,147.5 TV16.IB
N$3
  Top 0.61: U1.1 103.91,50.66 105.75,52.5 105.75,52.98 Q1.2
N$4
  Top 0.61: U1.2 100.61,49.38 100,50 100,52.5 100.5,53 Q1.1
N$5  (via drill 0.6)
  Top 0.61: U1.3 99.39,48.12 v98.5,49
  Bottom 1.27: BAT1.1 88,59.5 v98.5,49
N$6
  Top 0.813: U$8.15 102.83,94.42 103.5,93.75 104.75,93.75 105.36,94.36 U$8.13
N$7
  Top 0.813: U$8.4 105.36,92.36 106.64,93.64 U$8.12
N$8
  Top 1.27: SJ1.1 80.25,101.75 67.15,101.75 U$3.VOUT
N$9
  Top 1.27: U$6.VOUT SJ2.1
N$10
  Bottom 0.61: U$2.6 48.63,118.64 48,118 C4.2
N$11
  Top 0.813: U$7.15 89.83,94.42 90.5,93.75 91.75,93.75 92.36,94.36 U$7.13
N$12
  Top 1.27: LED1.C 12.75,31 14.25,29.5 R53.1
N$14
  cutout Bottom: 20,150 49.75,150 49.75,129.75 41,129.75 34.25,136.5 20,136.5
N$15
  Top 0.61: IC3.3 98.61,33.62 97.35,32.35 R54.2 97.35,32.15 98.5,31 100.73,31 R55.2
N$16
  Bottom 0.61: C6.2 37.5,119 36.37,117.86 U$4.6
N$17
  Bottom 10: 62.75,26.75 85.75,26.75
  Bottom 3.81: F1.1 70.77,109.77 | TO_GREY_REG.2 88.49,26.49 88.75,26.75 85.75,26.75
  Bottom 6.452: 61,27 61.25,26.75 61.5,26.75 | 61.5,26.75 62.75,26.75 | 61.5,26.75 60.25,28 60.25,89.75 63,92.5 70.5,92.5 74,96 74,106.5 70.77,109.73 70.77,109.77
N$18
  Top 0.61: R6.1 R5.2 97.48,34.88 IC3.2
N$19
  Top 1.27: R21.1 48.4,11.9 47.75,11.25 44.25,11.25 43.65,11.85 T1.C 42.82,14.83 D1.A
N$20
  Bottom 1.27: 119.54,33.04 D2.A | Q2.E 119.54,33.04 | FAN.2 121.04,31.54 119.54,33.04
N$21
  Bottom 1.778: B1.AC1 66.25,138 61.17,143.08 R33.2
  Bottom 2.54: TV16.OA 56.23,144.35 R33.2
N$22
  Top 0.61: T1.B 46.05,13.05 48,15 R20.2
N$24
  Top 1.27: R22.1 38.77,7.4 D1.C
N$26
  Top 1.016: C2.- 77.04,143.76 77.04,143.79 79.51,146.26 SJ6.2
  Bottom 1.778: B1.- 70.16,134.41 76,140.25 C2.-
N$28
  Top 0.813: U$7.4 92.36,92.36 93.64,93.64 U$7.12
N$35
  Bottom 0.813: R30.1 84.23,136.1 U$1.1
N$36
  Bottom 2.54: R32.2 44.9,131.67 TV16.IA
N$38
  Bottom 1.778: R33.1 57.58,132.92 B1.AC2
  Bottom 2.54: TV16.OB 56.23,131.65 R33.1
N$39
  Top 0.61: IC3.6 107.11,33.62 108.25,34.75 108.85,34.75 R57.2
N$40
  Top 1.27: Q2.B 112.69,28.5 110.5,28.5 109,30 R57.1
RPI_RESET
  Top 1.27: RPI_RESET.1 13.11,26.4 R53.2 64.4,26.4 78.5,40.5 78.5,55.5 81.5,58.5 96,58.5 98.5,61 98.5,65 101,67.5 116,67.5 117.5,69 117.5,78.5 119.12,80.12 PCB1.32
  Bottom 2.54: RPI_RESET.2 RPI_RESET.1
RTC_SCL
  Top 0.406: 122,48.38 119.31,48.38
  Top 0.813: PCB1.5 123.28,47.1 122,48.38 | U1.6 119.05,48.12 119.31,48.38
RTC_SDA
  Top 0.406: 122.06,45.81 119.31,45.81
  Top 0.813: PCB1.3 123.3,44.58 122.06,45.81 | 119.31,45.81 118.28,46.84 U1.5
SEL_SENSOR_1
  Top 0.813: U$1.14 100.2,110.55 102.88,107.88 | U$7.11 94.91,99.91 102.88,107.88 | 102.88,107.88 107.91,102.84 U$8.11
SEL_SENSOR_2  (via drill 0.6)
  Top 0.813: U$1.15 100.16,113.09 105.12,108.12 | 105.12,108.12 109.17,104.08 U$8.10 U$8.9 | v102.5,105.5 96.17,99.17 U$7.10 U$7.9 | v105.25,108.25 105.12,108.12
  Bottom 0.813: v102.5,105.5 v105.25,108.25
SENSOR_+6V5
  Top 0.61: U$8.5 106.64,80.64
  Top 0.813: 106.64,80.64 106.5,80.5
  Top 1.27: R14.2 R15.1 15.6,39.1 20.5,44 20.5,61.5 24.5,65.5 81.5,65.5 83.5,67.5 93.5,67.5 106.5,80.5
SENSOR_+12V
  Top 0.61: U$8.3 104.09,81.09 103.5,80.5
  Top 1.27: R16.2 R17.1 15.6,49.1 18,51.5 18,62.5 23.75,68.25 80.25,68.25 82.25,70.25 93.25,70.25 103.5,80.5
SENSOR_+13V5
  Top 0.61: U$8.2 102.83,87.83 100.5,85.5 100.5,80.5
  Top 1.27: R28.2 R29.1 15.6,63.6 22.75,70.75 78.75,70.75 81,73 93,73 100.5,80.5
SENSOR_+19V5
  Top 0.61: 97.5,80.5 97.5,86.75 100.68,89.93 U$8.1
  Top 1.27: R2.2 R3.1 15.6,69.1 19.75,73.25 77.25,73.25 79.75,75.75 92.75,75.75 97.5,80.5
SENSOR_+24V
  Top 0.61: U$7.5 93.64,80.64 93.5,80.5
  Top 1.27: R34.1 R4.2 15.6,76.9 16.75,75.75 75.75,75.75 78.25,78.25 91.25,78.25 93.5,80.5
SENSOR_+48V_A
  Top 0.61: U$7.2 89.83,84.83 89.5,84.5
  Top 1.27: R10.2 R11.1 15.6,104.1 19,107.5 30.5,107.5 34,104 34,92.5 37,89.5 74,89.5 74.75,88.75 80.25,83.25 88.25,83.25 89.5,84.5
SENSOR_+48V_B
  Top 0.61: U$7.3 91.09,82.09 91,82
  Top 1.27: R12.2 R13.1 | R13.1 15.6,89.1 | R13.1 15.6,98.1 22.5,105 29.5,105 31.5,103 31.5,91.5 36,87 73,87 79.25,80.75 89.75,80.75 91,82
SENSOR_IBAT  (via drill 0.6)
  Top 1.016: v37.5,114 37,114.5 37,117.25 44.5,124.75 66.75,124.75 82.5,140.5 87,140.5 89.5,138 89.5,123.5 92.29,120.71 U$1.18
  Bottom 0.61: U$4.7 37.63,114.14 v37.5,114
SENSOR_ILOAD  (via drill 0.6)
  Top 1.016: v47.5,122.25 48.25,123 68,123 83.5,138.5 86,138.5 87.5,137 87.5,122.25 91.58,118.17 U$1.17
  Bottom 0.61: U$2.7 47.37,122.11 v47.5,122.25
SENSOR_SPLY_A
  Top 0.813: U$7.14 91.09,97.59 93.27,99.77 U$1.28
SENSOR_SPLY_B  (via drill 0.6)
  Top 0.813: U$8.14 104.09,97.41 v100.5,101 | U$1.27 95.81,105.69 v97,104.5
  Bottom 0.813: v97,104.5 v100.5,101
SENSOR_VAC
  Top 1.016: U$1.20 94.21,125.79 93.5,126.5 93.5,139 95,140.5 101,140.5 102.5,142 102.5,147.5 101,149 88.92,149 D3.C
  Bottom 1.778: B1.+ 66.25,141.75 70.75,146.25 75.97,146.25 C2.+ 86.2,146.28 D3.C
SENSOR_VBAT
  Top 0.813: U$7.1 87.57,89.93
  Top 1.27: R8.1 R7.2 29,112.5 36.5,105 36.5,93.5 38,92 78,92 80.07,89.93 87.57,89.93
SENSOR_VPWRSPLY
  Top 0.813: R18.1 25.15,134.65 26,135.5 30,135.5 30.85,134.65 R9.2
  Top 1.016: R9.2 30.85,132.9 33.25,130.5 33.25,121.5 34.5,120.25 37,120.25 43.25,126.5 65.5,126.5 81.5,142.5 88,142.5 91.5,139 91.5,124.5 92.75,123.25 U$1.19
VBAT
  Top 1.27: R7.1 29,118.5 VPWRSPLY&VBAT.3
  Bottom 0.61: U$4.3 U$4.4
  Bottom 2.54: U$4.4 34.62,111.38
  Bottom 3.81: 34.62,111.38 28,118 VPWRSPLY&VBAT.3
VLOAD
  Bottom 0.61: U$2.3 U$2.4
  Bottom 2.54: U$2.4 50.37,125.87
  Bottom 3.81: 50.37,125.87 58,125.87 | 58,125.87 65.5,125.87 | F1.2 74.23,124 72.37,125.87 65.5,125.87 | F3.2 65.73,125.64 65.5,125.87 | F2.2 57.23,125.1 58,125.87
  pour Bottom (isolate 1.27): 48.5,128 48.5,123.5 52,123.5 52.5,123.5 52.5,117 76.75,117 76.75,126.25 75,128
VPWRSPLY
  Top 0.813: R9.1 29.15,132.35 31.5,130 31.5,127 29,124.5 VPWRSPLY&VBAT.2
  Bottom 0.61: U$2.2 46.13,125.87 U$2.1 | U$4.2 U$4.1
  Bottom 2.54: U$4.1 39.38,111.38 | 46.13,125.87 45.63,125.87
  Bottom 3.81: 42.5,125.87 31.37,125.87 30,124.5 VPWRSPLY&VBAT.2 | 39.38,111.38 42.5,114.5 42.5,125.87 | 45.63,125.87 42.5,125.87